# EasyEDA Pro project 第十三届国赛真题.eprj

# Schematic EDA_LQ_13F
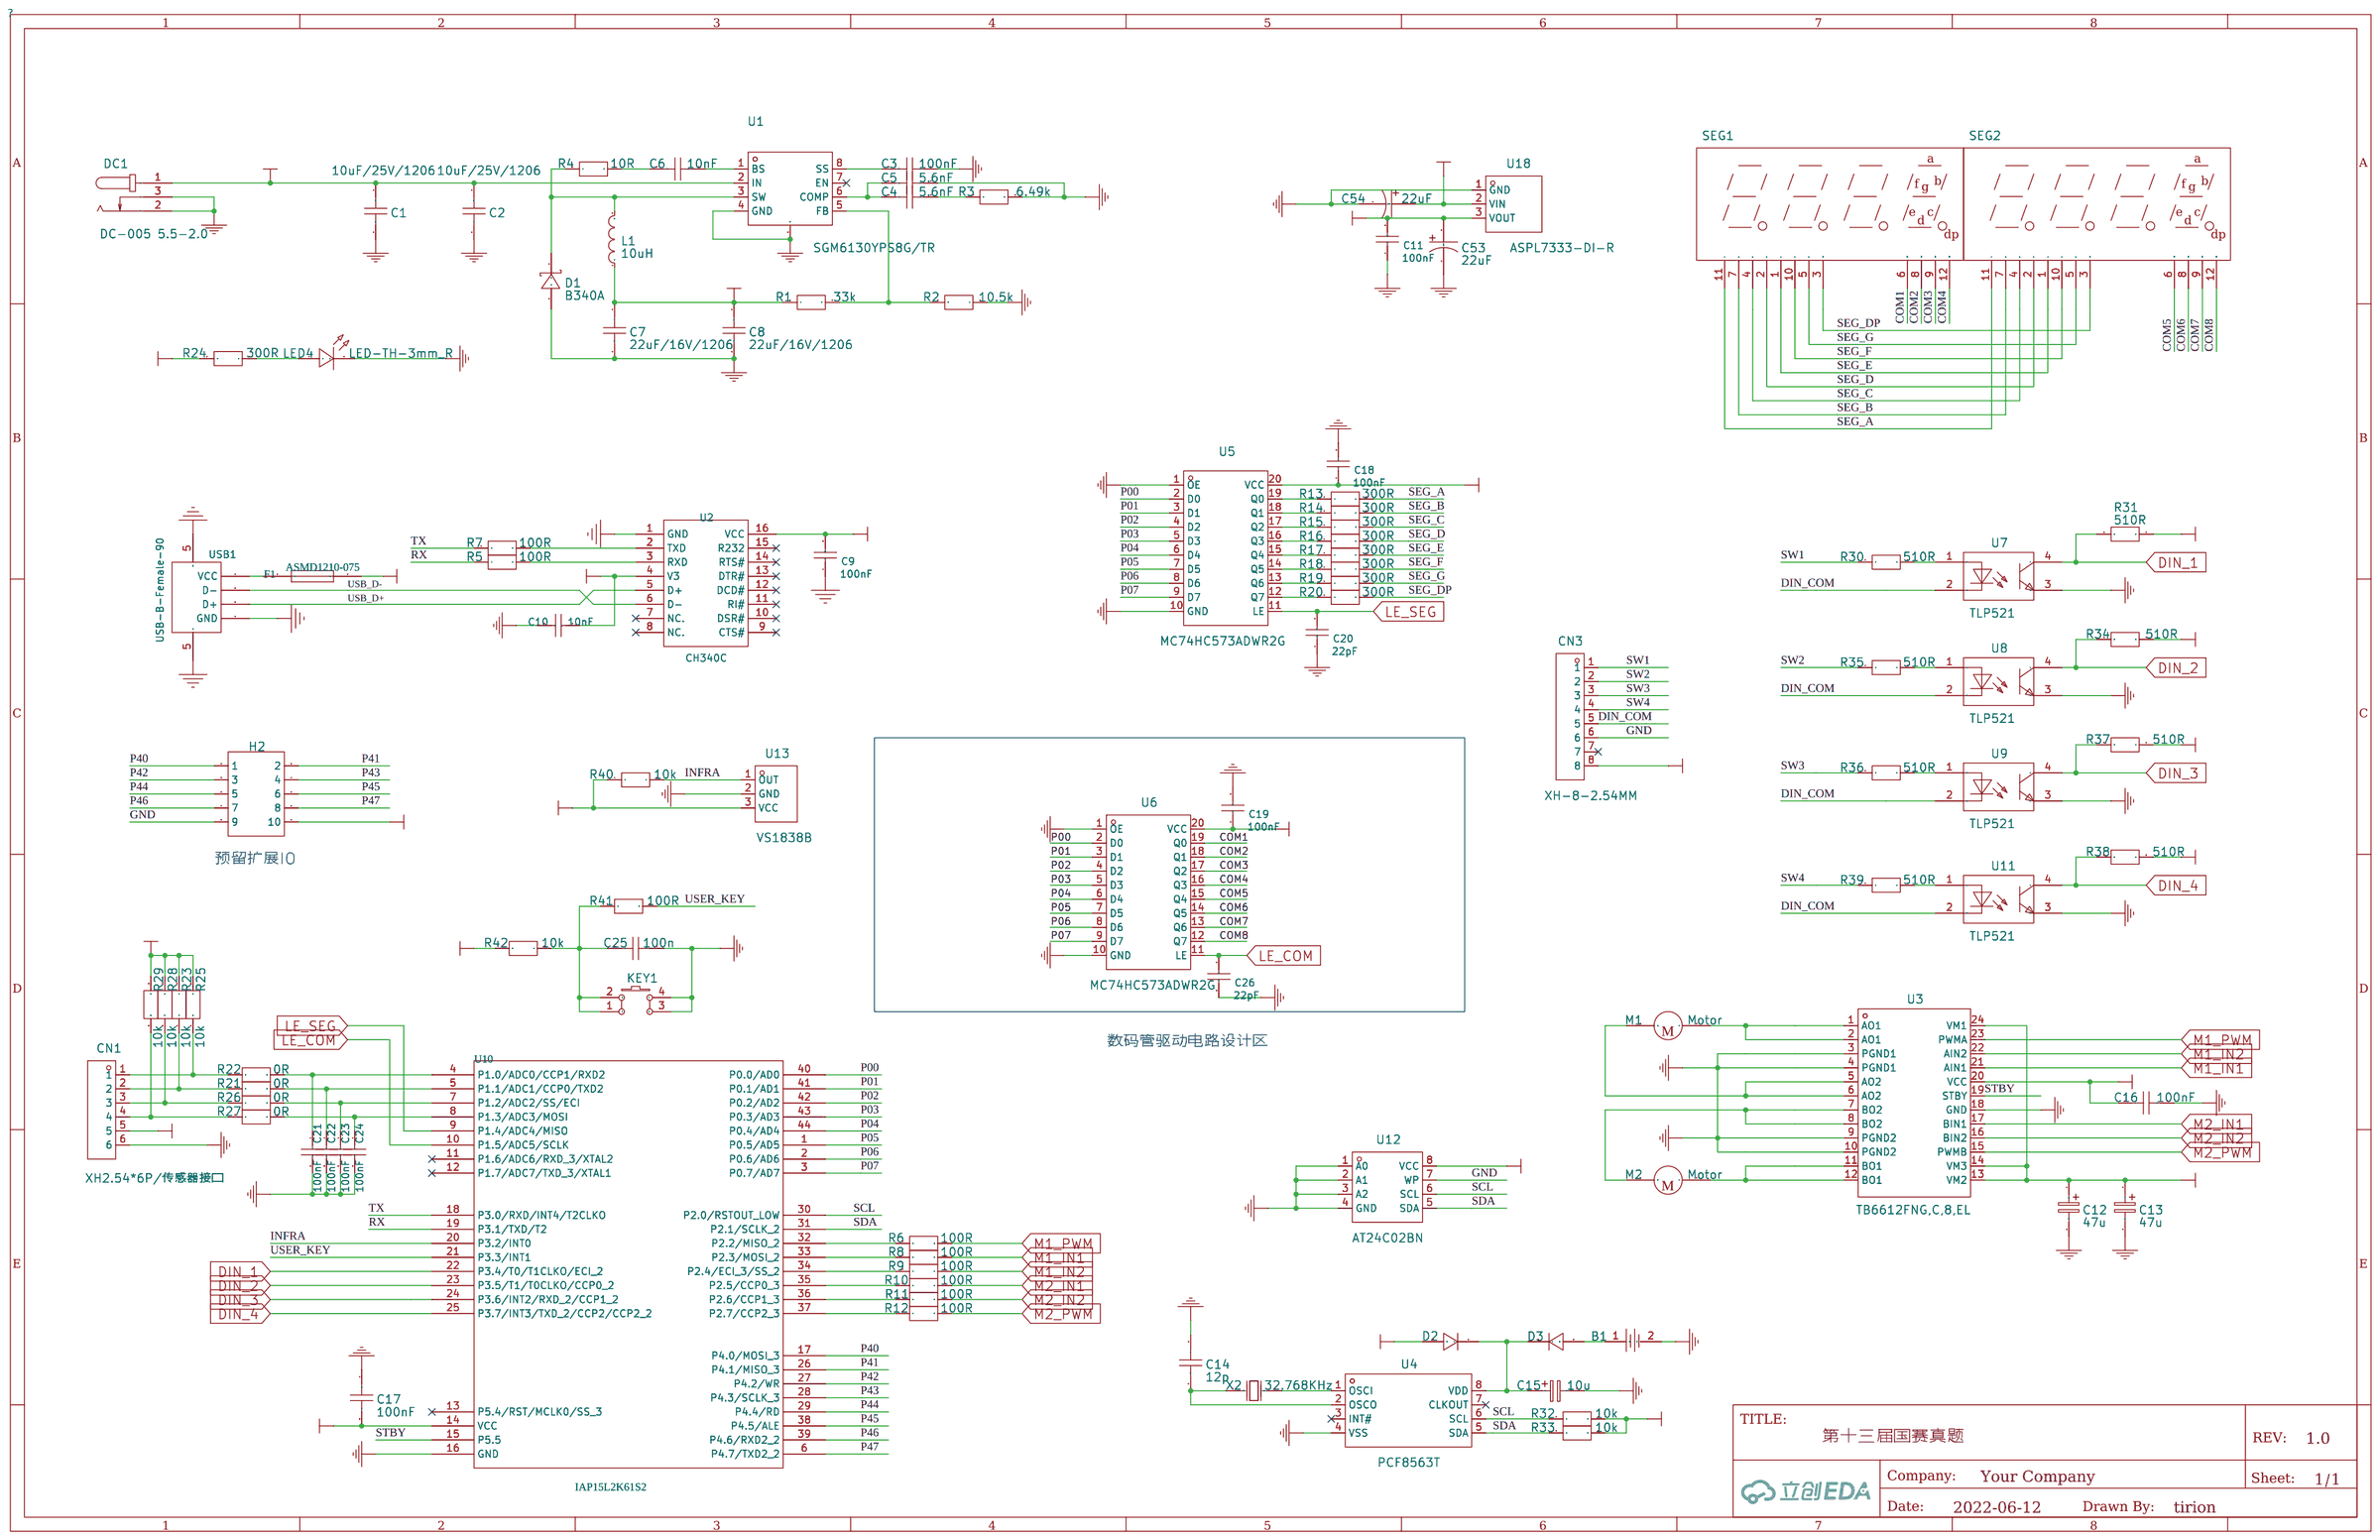
[diagram p0: schematic sheet]

## Parts
B1  CR1220-2  [BAT-SMD_CR1220-2]
C1  10uF/25V/1206  [C1206]
C2  10uF/25V/1206  [C1206]
C3  100nF  [C_C0805]
C4  5.6nF  [C_C0805]
C5  5.6nF  [C_C0805]
C6  10nF  [C_C0805]
C7  22uF/16V/1206  [C1206]
C8  22uF/16V/1206  [C1206]
C9  100nF  [C_C0805]
C10  10nF  [C_C0805]
C11  100nF  [C_C0805]
C12  47u  [CAP-D6.3×H5.5]
C13  47u  [CAP-D6.3×H5.5]
C14  12p  [C_C0805]
C15  10u  [CAP-D5.0×H5.5]
C16  100nF  [C_C0805]
C17  100nF  [C_C0805]
C18  100nF  [C_C0805]
C19  100nF  [C_C0805]
C20  22pF  [C_C0805]
C21  100nF  [C_C0805]
C22  100nF  [C_C0805]
C23  100nF  [C_C0805]
C24  100nF  [C_C0805]
C25  100n  [C_C0805]
C26  22pF  [C_C0805]
C53  22uF  [CAP-SMD_BD6.3-L6.6-W6.6-FD]
C54  22uF  [CAP-SMD_BD6.3-L6.6-W6.6-FD]
CN1  XH2.54*6P/传感器接口  [CONN-TH_XH2.54-6P]
CN3  XH-8-2.54MM  [CONN-TH_8P-P2.50-XH2.54-8P]
D1  B340A  [SMA_L4.3-W2.6-LS5.2-RD]
D2  1N4148  [DO-35_BD2.0-L4.2-P8.20-D0.5-RD]
D3  1N4148  [DO-35_BD2.0-L4.2-P8.20-D0.5-RD]
DC1  DC-005 5.5-2.0  [DC-IN-TH_DC005]
F1  ASMD1210-075  [R_R1210]
H2  HDR-F-2.54_2x5  [HDR-F-2.54_2X5]
KEY1  K4-6×6_SMD  [KEY-SMD_4P-L6.0-W6.0-P3.90-LS10.0]
L1  10uH  [IND-SMD_L8.3-W8.3]
LED4  LED-TH-3mm_R  [LED-TH_BD3.0_RED]
M1  Motor  [CONN-TH_2P-P5.08-WJ500V-5.08-2P]
M2  Motor  [CONN-TH_2P-P5.08-WJ500V-5.08-2P]
R1  33k  [R_R0805]
R2  10.5k  [R_R0805]
R3  6.49k  [R_R0805]
R4  10R  [R_R0805]
R5  100R  [R_R0805]
R6  100R  [R_R0805]
R7  100R  [R_R0805]
R8  100R  [R_R0805]
R9  100R  [R_R0805]
R10  100R  [R_R0805]
R11  100R  [R_R0805]
R12  100R  [R_R0805]
R13  300R  [R_R0805]
R14  300R  [R_R0805]
R15  300R  [R_R0805]
R16  300R  [R_R0805]
R17  300R  [R_R0805]
R18  300R  [R_R0805]
R19  300R  [R_R0805]
R20  300R  [R_R0805]
R21  0R  [R_R0805]
R22  0R  [R_R0805]
R23  10k  [R_R0805]
R24  300R  [R_R0805]
R25  10k  [R_R0805]
R26  0R  [R_R0805]
R27  0R  [R_R0805]
R28  10k  [R_R0805]
R29  10k  [R_R0805]
R30  510R  [R_R0805]
R31  510R  [R_R0805]
R32  10k  [R_R0805]
R33  10k  [R_R0805]
R34  510R  [R_R0805]
R35  510R  [R_R0805]
R36  510R  [R_R0805]
R37  510R  [R_R0805]
R38  510R  [R_R0805]
R39  510R  [R_R0805]
R40  10k  [R_R0805]
R41  100R  [R_R0805]
R42  10k  [R_R0805]
SEG1  0.36寸4位数码管  [LED-SEG-TH_FJ5461AH]
SEG2  0.36寸4位数码管  [LED-SEG-TH_FJ5461AH]
U1  SGM6130YPS8G/TR  [SOIC-8_L5.0-W4.0-P1.27-LS6.0-BL-EP2.0]
U2  CH340C  [SOP-16-N]
U3  TB6612FNG,C,8,EL  [SSOP-24_L8.3-W5.6-P0.65-LS7.6-BL]
U4  PCF8563T  [SOIC-8_L5.0-W4.0-P1.27-LS6.0-BL]
U5  MC74HC573ADWR2G  [SOIC-20_L13.0-W7.6-P1.27-LS10.3-BL]
U6  MC74HC573ADWR2G  [SOIC-20_L13.0-W7.6-P1.27-LS10.3-BL]
U7  TLP521  [OP-4]
U8  TLP521  [OP-4]
U9  TLP521  [OP-4]
U10  IAP15L2K61S2  [QFP-LQFP-44]
U11  TLP521  [OP-4]
U12  AT24C02BN  [SOP-8_L4.9-W3.9-P1.27-LS6.0-TL]
U13  VS1838B  [OPTO-TH_VS1838B]
U18  ASPL7333-DI-R  [SOT-89-3_L4.5-W2.5-P1.50-LS4.2-BR]
USB1  USB-B-Female-90  [S_USB-B]
X2  32.768KHz  [XTAL-DT38]

## Library data of the parts
B1 = CR1220-2: Supplier: LCSC; Manufacturer: Q&amp;J; Supplier Part: C70381; JLCPCB Part Class: ExtendedPart
C1 C2 = 10uF/25V/1206
C3 C16 C17 = 100nF
C4 C5 = 5.6nF
C6 = 10nF
C7 C8 = 22uF/16V/1206
C9-C11 C18-C24 C26 = 0805F104M500NT: Supplier: LCSC; Manufacturer: FH; Supplier Part: C28378
C12 C13 = 47u
C14 = 12p
C15 = 10u
C25 = 100n
C53 C54 = -: Supplier: LCSC; Supplier Part: C27783; Manufacturer: HonorElec
CN1 = XH2.54*6P_直插: Supplier: LCSC; Supplier Part: C9900008614; Manufacturer: null; JLCPCB Part Class: ExtendedPart
CN3 = XH-8-2.54MM: Supplier: LCSC; Supplier Part: C9900005540; JLCPCB Part Class: ExtendedPart
D1 = B340A: Supplier: LCSC; Manufacturer: MDD; Supplier Part: C64982; JLCPCB Part Class: Extended Part
D2 D3 = 1N4148: Supplier: LCSC; Supplier Part: C13769; Manufacturer: STMicroelectronics
DC1 = -: Supplier: LCSC; Supplier Part: C132516; Manufacturer: ShenzhenCankemeng; JLCPCB Part Class: Extended Part
F1 = ASMD1210-075: Published: 8-Jun-2000; LatestRevisionDate: 17-Jul-2002; LatestRevisionNote: Re-released for DXP Platform.; PackageReference: PIN-W2/E2.8; Publisher: Altium Limited; PackageDescription: Thru-Hole; 2 Leads
H2 = HDR-F-2.54_2x5: Supplier Part: C30419; Supplier: LCSC
KEY1 = K2-6639SP-D4SC-04: Supplier Part: C191626; Supplier: LCSC; Manufacturer: 韩国韩荣
L1 = 1217AS-H-100M=P3: Supplier: LCSC; Supplier Part: C237597; Manufacturer: MurataElectronics; JLCPCB Part Class: ExtendedPart
LED4 = 204-10SDRD/S530-A3-L: Manufacturer: EVERLIGHT(台湾亿光); Supplier Part: C84774; Supplier: LCSC
M1 M2 = Motor
R1 = 33k
R2 = 10.5k
R3 = 6.49k
R4 = 10R
R5-R12 R41 = 100R
R13-R20 R24 = 300R
R21 R22 R26 R27 = 0R
R23 R25 R28 R29 R32 R33 R40 R42 = 10k
R30 R31 R34-R39 = 510R
SEG1 SEG2 = FJ5461BH 纯红: Supplier: LCSC; Manufacturer Part: FJ5461BH纯红; Manufacturer: ReliaPro; Supplier Part: C38183
U1 = SGM6130YPS8G/TR: Supplier: LCSC; Manufacturer: SGMICRO; Supplier Part: C87094; JLCPCB Part Class: Extended Part
U2 = CH340C: Supplier: LCSC; Manufacturer: WCH; Supplier Part: C84681; JLCPCB Part Class: Extend
U3 = TB6612FNG,C,8,EL: Supplier: LCSC; Manufacturer: TOSHIBA; Supplier Part: C141517; JLCPCB Part Class: ExtendedPart
U4 = PCF8563T/5,518: Supplier: LCSC; Manufacturer: NXP; Supplier Part: C7440; JLCPCB Part Class: BasicPart
U5 U6 = MC74HC573ADWR2G: Supplier: LCSC; Supplier Part: C233618; Manufacturer: ONSemicon; JLCPCB Part Class: ExtendedPart
U7-U9 U11 = TLP521: Supplier: LCSC; Supplier Part: C9900005355; Manufacturer: null; link: https://atta.szlcsc.comnull; JLCPCB Part Class: ExtendedPart
U10 = IAP15L2K61S2: ________: STC15ϵ_е_Ƭ__
U12 = AT24C02BN: Supplier: LCSC; Supplier Part: C9900013198; Manufacturer: null; JLCPCB Part Class: ExtendedPart
U13 = VS1838B: Supplier: LCSC; Supplier Part: C9900002107; Manufacturer: null; JLCPCB Part Class: ExtendedPart
U18 = ASPL7333-DI-R: Supplier: LCSC; Supplier Part: C2758205; Manufacturer: Ascend(安森德); JLCPCB Part Class: Extended Part
USB1 = USB-BF90: Supplier: LCSC; Manufacturer: ValuePro; image: //image.lceda.cn/szlcsc/C46392.jpg; Supplier Part: C46392
X2 = 6K832768F12UB: Supplier: LCSC; Supplier Part: C252404; Manufacturer: SHENZHENCRYSTALTECH

## Nets
+3V3: C7.1 C8.1 C9.2 C10.1 C11.2 C16.1 C17.2 C18.1 C19.1 C53.1 CN1.5 D2.2 H2.10 L1.1 R1.1 R23.1 R24.2 R25.1 R28.1 R29.1 R31.1 R32.2 R33.2 R34.1 R37.1 R38.1 R40.1 R42.2 U2.4(V3) U2.16(VCC) U3.20(VCC) U5.20(VCC) U6.20(VCC) U10.14(VCC) U12.8(VCC) U13.3(VCC) U18.3(VOUT)
GND: B1.2 C1.1 C2.1 C3.1 C5.1 C7.2 C8.2 C9.1 C10.2 C11.1 C12.2 C13.2 C14.1 C15.2 C16.2 C17.1 C18.2 C19.2 C20.1 C21.2 C22.2 C23.2 C24.2 C25.2 C26.1 C53.2 C54.2 CN1.6 CN3.6 D1.2(A) DC1.2 DC1.3 H2.9 KEY1.3 KEY1.4 LED4.2 R2.1 R3.2 U1.4(GND) U1.9 U2.1(GND) U3.3(PGND1) U3.4(PGND1) U3.9(PGND2) U3.10(PGND2) U3.18(GND) U4.4(VSS) U5.1(OE) U5.10(GND) U6.1(OE) U6.10(GND) U7.3 U8.3 U9.3 U10.16(GND) U11.3 U12.1(A0) U12.2(A1) U12.3(A2) U12.4(GND) U12.7(WP) U13.2(GND) U18.1(GND) USB1.4(GND) USB1.5(SH2)
COM1: SEG1.6(DIG4) U6.19(Q0)
COM2: SEG1.8(DIG3) U6.18(Q1)
COM3: SEG1.9(DIG2) U6.17(Q2)
COM4: SEG1.12(DIG1) U6.16(Q3)
COM5: SEG2.6(DIG4) U6.15(Q4)
COM6: SEG2.8(DIG3) U6.14(Q5)
COM7: SEG2.9(DIG2) U6.13(Q6)
COM8: SEG2.12(DIG1) U6.12(Q7)
DC_IN: C1.2 C2.2 C12.1 C13.1 CN3.8 DC1.1 U1.2(IN) U3.13(VM2) U3.14(VM3) U3.24(VM1)
DIN_1: R31.2 U7.4 U10.22(P3.4/T0/T1CLKO/ECI_2)
DIN_2: R34.2 U8.4 U10.23(P3.5/T1/T0CLKO/CCP0_2)
DIN_3: R37.2 U9.4 U10.24(P3.6/INT2/RXD_2/CCP1_2)
DIN_4: R38.2 U10.25(P3.7/INT3/TXD_2/CCP2/CCP2_2) U11.4
DIN_COM: CN3.5 U7.2 U8.2 U9.2 U11.2
INFRA: R40.2 U10.20(P3.2/INT0) U13.1(OUT)
LE_COM: C26.2 U6.11(LE) U10.10(P1.5/ADC5/SCLK)
LE_SEG: C20.2 U5.11(LE) U10.9(P1.4/ADC4/MISO)
M1_IN1: R8.2 U3.21(AIN1)
M1_IN2: R9.2 U3.22(AIN2)
M1_PWM: R6.2 U3.23(PWMA)
M2_IN1: R10.2 U3.17(BIN1)
M2_IN2: R11.2 U3.16(BIN2)
M2_PWM: R12.2 U3.15(PWMB)
P00: U5.2(D0) U6.2(D0) U10.40(P0.0/AD0)
P01: U5.3(D1) U6.3(D1) U10.41(P0.1/AD1)
P02: U5.4(D2) U6.4(D2) U10.42(P0.2/AD2)
P03: U5.5(D3) U6.5(D3) U10.43(P0.3/AD3)
P04: U5.6(D4) U6.6(D4) U10.44(P0.4/AD4)
P05: U5.7(D5) U6.7(D5) U10.1(P0.5/AD5)
P06: U5.8(D6) U6.8(D6) U10.2(P0.6/AD6)
P07: U5.9(D7) U6.9(D7) U10.3(P0.7/AD7)
P40: H2.1 U10.17(P4.0/MOSI_3)
P41: H2.2 U10.26(P4.1/MISO_3)
P42: H2.3 U10.27(P4.2/WR)
P43: H2.4 U10.28(P4.3/SCLK_3)
P44: H2.5 U10.29(P4.4/RD)
P45: H2.6 U10.38(P4.5/ALE)
P46: H2.7 U10.39(P4.6/RXD2_2)
P47: H2.8 U10.6(P4.7/TXD2_2)
RX: R5.1 U10.19(P3.1/TXD/T2)
SCL: R32.1 U4.6(SCL) U10.30(P2.0/RSTOUT_LOW) U12.6(SCL)
SDA: R33.1 U4.5(SDA) U10.31(P2.1/SCLK_2) U12.5(SDA)
SEG_A: R13.2 SEG1.11(A) SEG2.11(A)
SEG_B: R14.2 SEG1.7(B) SEG2.7(B)
SEG_C: R15.2 SEG1.4(C) SEG2.4(C)
SEG_D: R16.2 SEG1.2(D) SEG2.2(D)
SEG_DP: R20.2 SEG1.3(DP) SEG2.3(DP)
SEG_E: R17.2 SEG1.1(E) SEG2.1(E)
SEG_F: R18.2 SEG1.10(F) SEG2.10(F)
SEG_G: R19.2 SEG1.5(G) SEG2.5(G)
STBY: U3.19(STBY) U10.15(P5.5)
SW1: CN3.1 R30.1
SW2: CN3.2 R35.1
SW3: CN3.3 R36.1
SW4: CN3.4 R39.1
TX: R7.1 U10.18(P3.0/RXD/INT4/T2CLKO)
USB_D+: U2.5(D+) USB1.3(D+)
USB_D-: U2.6(D-) USB1.2(D-)
USER_KEY: R41.1 U10.21(P3.3/INT1)
VUSB: C54.1 F1.2 U18.2(VIN)
$1N152: R1.2 R2.2 U1.5(FB)
$1N163: D1.1(K) L1.2 R4.1 U1.3(SW)
$1N174: C6.2 R4.2
$1N175: C6.1 U1.1(BS)
$1N178: C4.2 C5.2 U1.6(COMP)
$1N183: C4.1 R3.1
$1N190: C3.2 U1.8(SS)
$1N257: R5.2 U2.3(RXD)
$1N264: R7.2 U2.2(TXD)
$1N421: C15.1 D2.1 D3.1 U4.8(VDD)
$1N474: C14.2 U4.2(OSCO) X2.1(OSC1)
$1N475: U4.1(OSCI) X2.2(OSC2)
$1N489: B1.1 D3.2
$1N559: F1.1 USB1.1(VCC)
$1N587: LED4.1 R24.1
$1N603: M1.1 U3.1(AO1) U3.2(AO1)
$1N604: M1.2 U3.5(AO2) U3.6(AO2)
$1N614: M2.2 U3.7(BO2) U3.8(BO2)
$1N615: M2.1 U3.11(BO1) U3.12(BO1)
$1N755: R6.1 U10.32(P2.2/MISO_2)
$1N767: R8.1 U10.33(P2.3/MOSI_2)
$1N779: R9.1 U10.34(P2.4/ECI_3/SS_2)
$1N791: R10.1 U10.35(P2.5/CCP0_3)
$1N803: R11.1 U10.36(P2.6/CCP1_3)
$1N815: R12.1 U10.37(P2.7/CCP2_3)
$1N1018: R13.1 U5.19(Q0)
$1N1030: R14.1 U5.18(Q1)
$1N1042: R15.1 U5.17(Q2)
$1N1054: R16.1 U5.16(Q3)
$1N1066: R17.1 U5.15(Q4)
$1N1078: R18.1 U5.14(Q5)
$1N1090: R19.1 U5.13(Q6)
$1N1102: R20.1 U5.12(Q7)
$1N1137: CN1.2 R21.1 R23.2
$1N1138: C22.1 R21.2 U10.5(P1.1/ADC1/CCP0/TXD2)
$1N1139: CN1.1 R22.1 R25.2
$1N1140: C21.1 R22.2 U10.4(P1.0/ADC0/CCP1/RXD2)
$1N1172: CN1.3 R26.1 R28.2
$1N1173: C23.1 R26.2 U10.7(P1.2/ADC2/SS/ECI)
$1N1183: CN1.4 R27.1 R29.2
$1N1184: C24.1 R27.2 U10.8(P1.3/ADC3/MOSI)
$1N1282: R30.2 U7.1
$1N1335: R35.2 U8.1
$1N1380: R36.2 U9.1
$1N1445: R39.2 U11.1
$1N1633: C25.1 KEY1.1 KEY1.2 R41.2 R42.1

Not connected (* = marked no-connect by the designer): CN3 7*; U1 7(EN)*; U2 7(NC.)* 8(NC.)* 9(CTS#)* 10(DSR#)* 11(RI#)* 12(DCD#)* 13(DTR#)* 14(RTS#)* 15(R232)*; U4 3(INT#)* 7(CLKOUT)*; U10 11(P1.6/ADC6/RXD_3/XTAL2)* 12(P1.7/ADC7/TXD_3/XTAL1)* 13(P5.4/RST/MCLK0/SS_3)*

## Notes on the sheet
- 预留扩展IO
- 数码管驱动电路设计区

# Board PCB
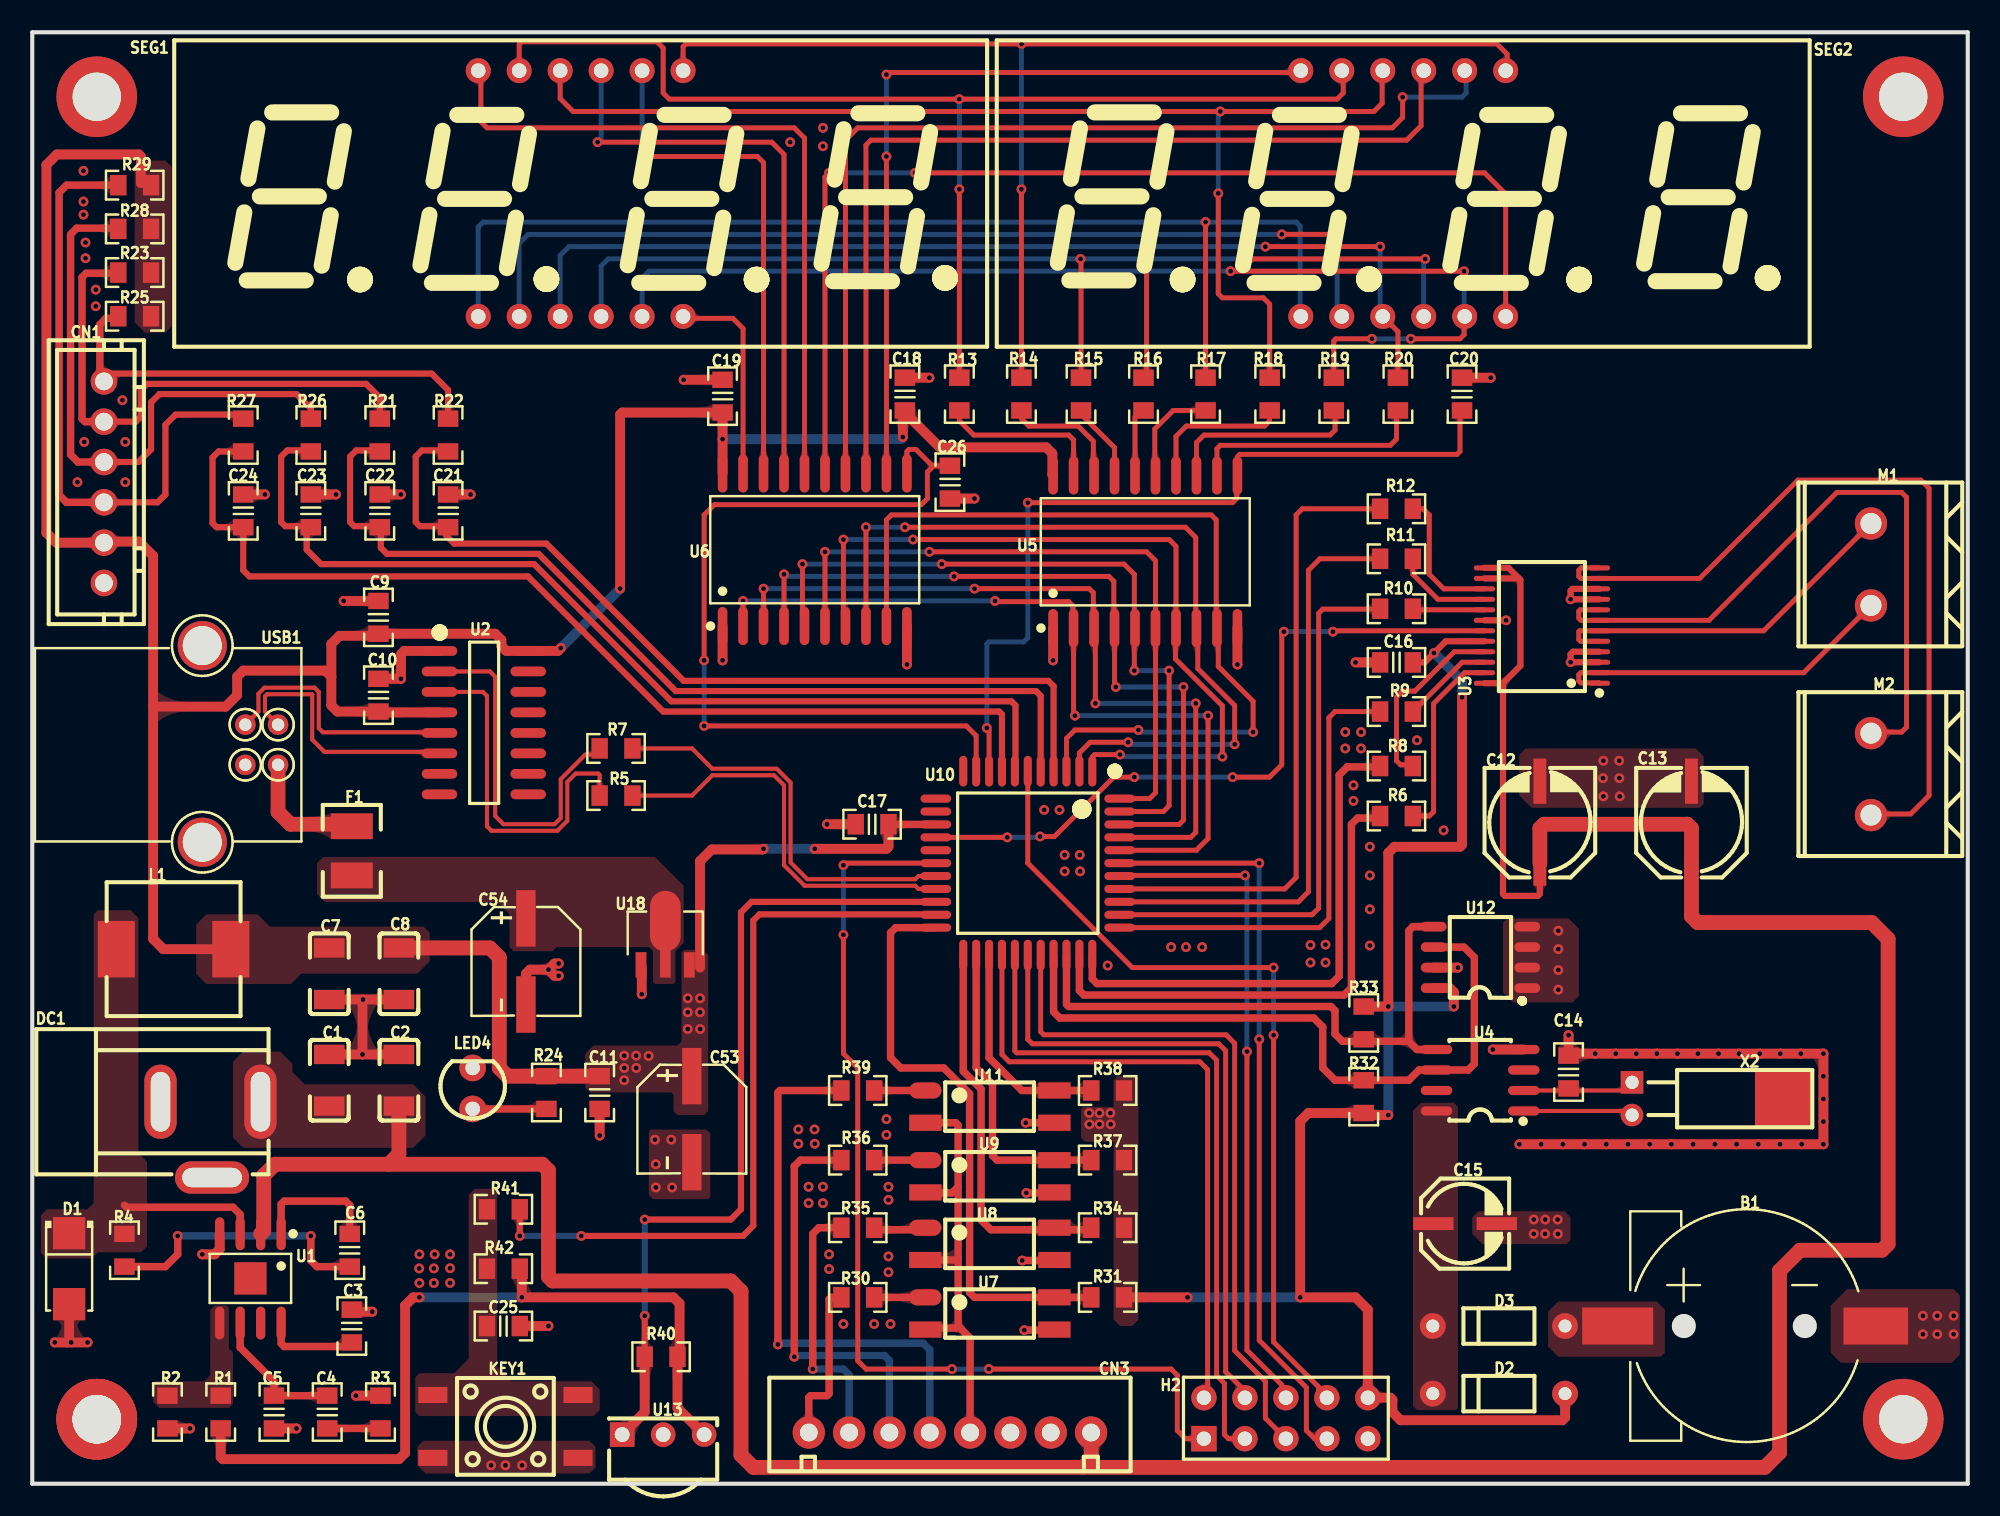
[diagram p1: board, top side]
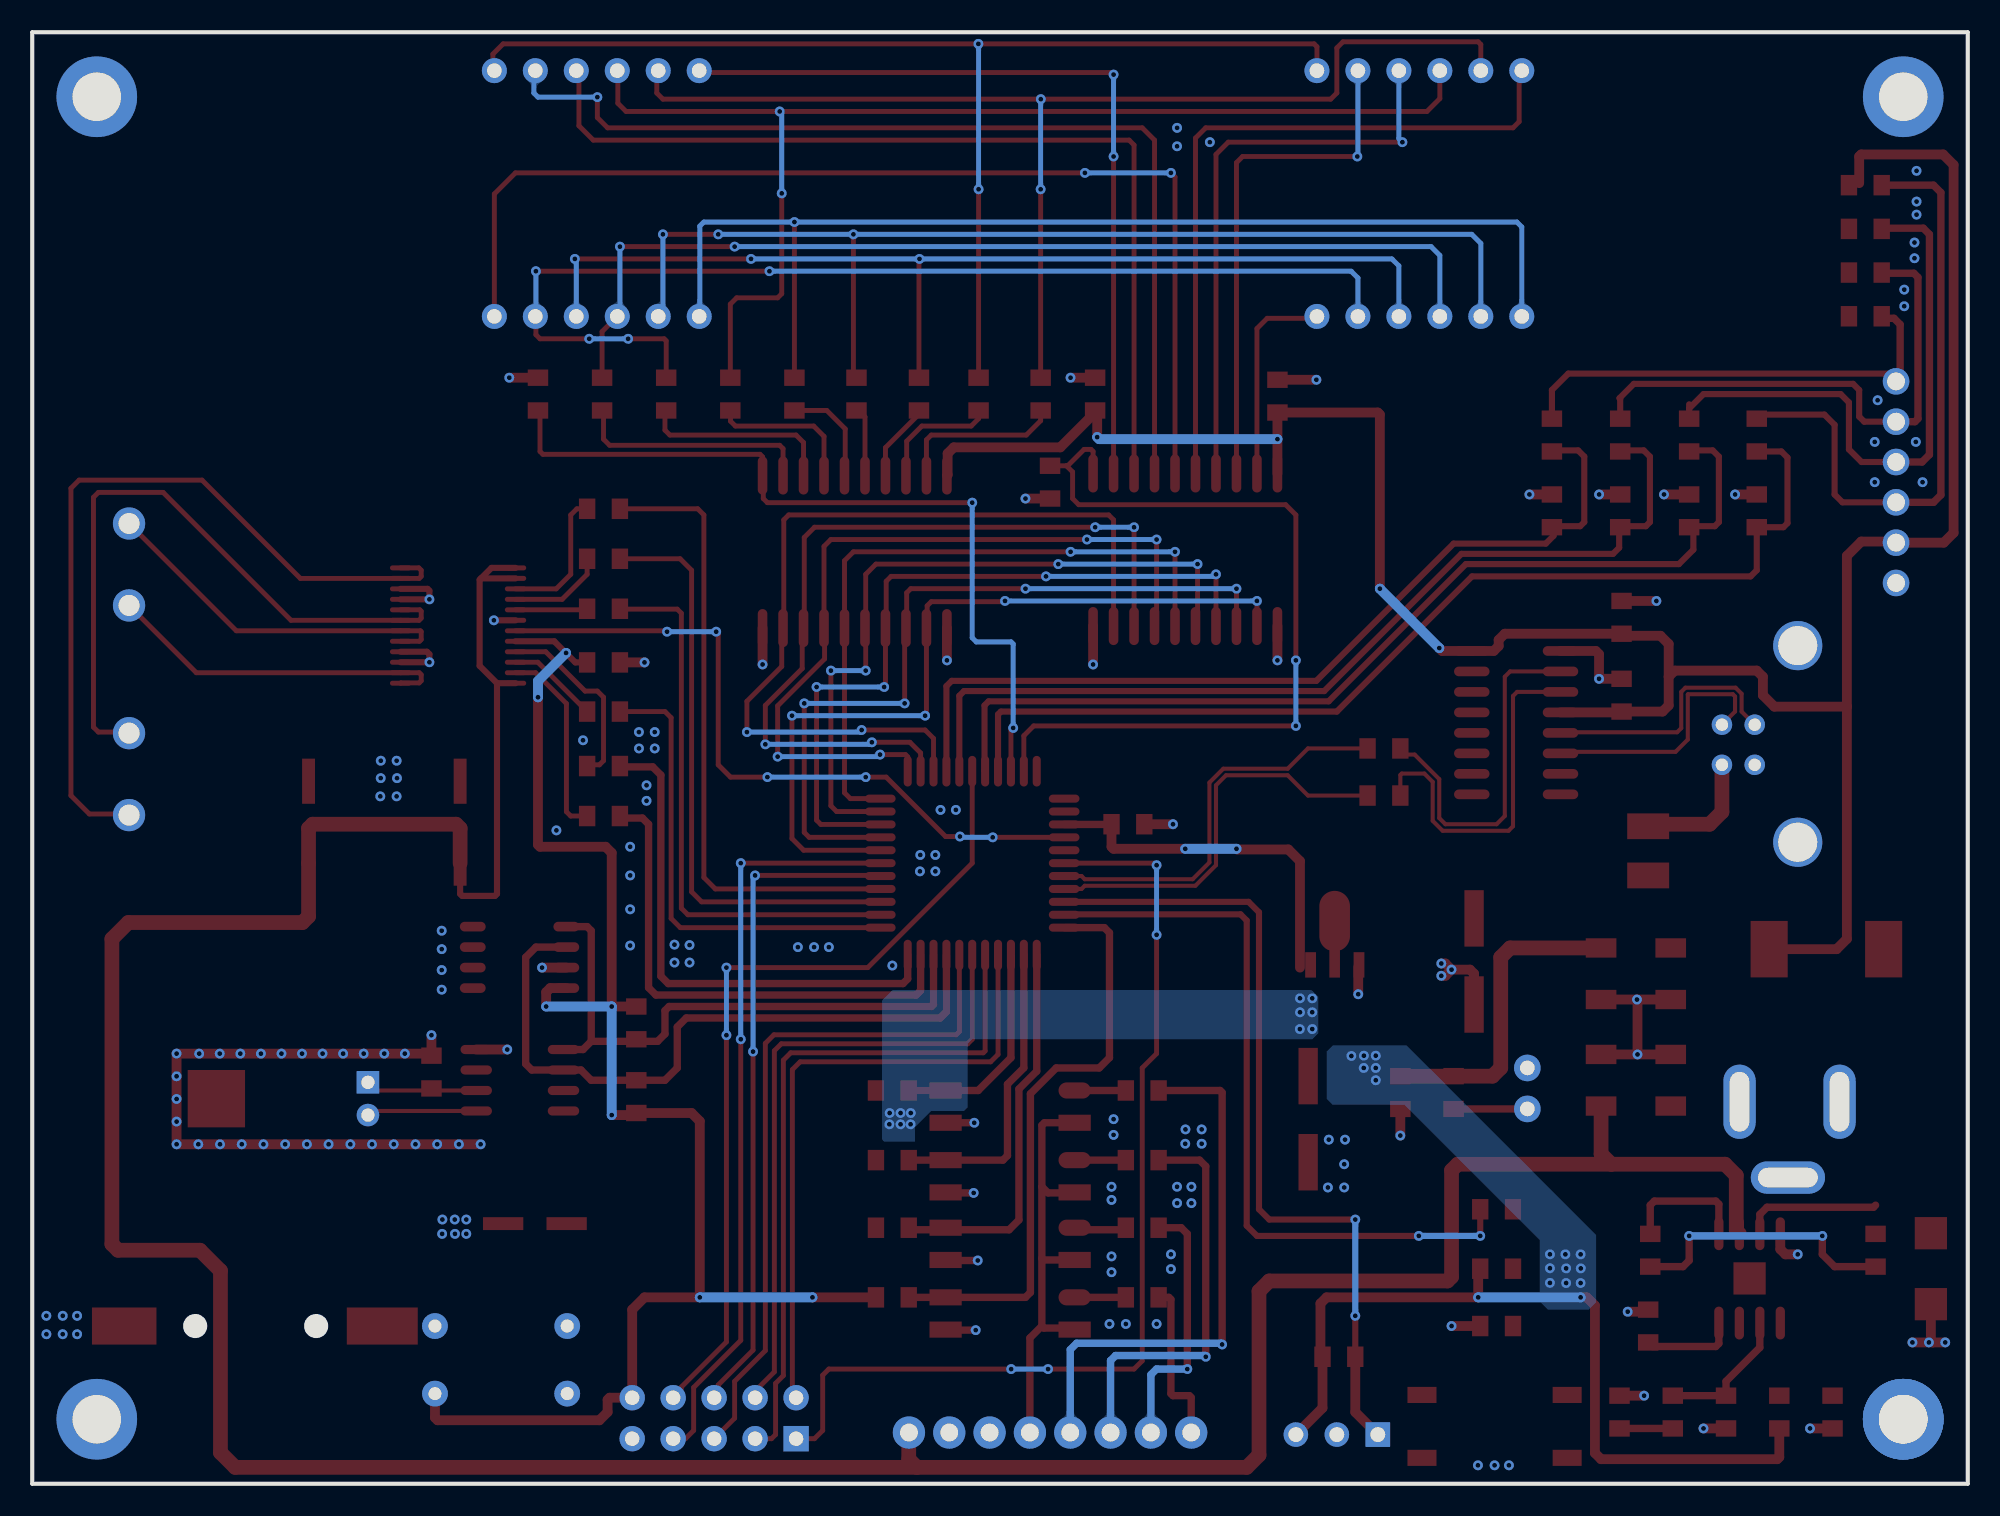
[diagram p2: board, bottom side, seen from below]

Outline 120 x 90 mm; copper layers: Top Layer, Bottom Layer. Coordinates in mm from the lower left corner of the outline.
Outline path: 0,90 120,90 120,0 0,0 0,90
Stack: Top Layer 0.035mm / Dielectric1 1.51mm FR4 er 4.5 / Bottom Layer 0.035mm

## Design rules (mm)
net USB_D+: DP1
net USB_D-: DP1
net $1N264: DP2
net $1N257: DP2
net TX: DP3
net RX: DP3
net $1N474: DP4
net $1N475: DP4
template: 用户自定义配置
spacing Default (default): track to track 0.254, other pairs 0 to 0.305
track width Default (default): min 0.305, default 0.305, max 25.4
track width PWR: min 0.305, default 0.61, max 2.54
differential pair differentialPair (default): width min 0.127, default 0.254, max 2.54; gap min 0.152, default 0.152
via Default (default): diameter min 0.61, default 0.61, max 100.025; hole min 0.305, default 0.305, max 59.995
net GND uses PWR
net +3V3 uses PWR
net VUSB uses PWR

## Placement (name value [footprint] x y rotation side)
B1  CR1220-2  [BAT-SMD_CR1220-2]  106.3 9.78 0 top
C1  10uF/25V/1206  [C1206]  18.42 25.02 270 top
C2  10uF/25V/1206  [C1206]  22.73 25.02 270 top
C3  100nF  [C_C0805]  19.81 10.79 270 top
C4  5.6nF  [C_C0805]  18.29 3.43 90 top
C5  5.6nF  [C_C0805]  14.99 3.43 90 top
C6  10nF  [C_C0805]  19.69 15.49 270 top
C7  22uF/16V/1206  [C1206]  18.42 31.62 270 top
C8  22uF/16V/1206  [C1206]  22.73 31.62 270 top
C9  100nF  [C_C0805]  21.46 54.74 270 top
C10  10nF  [C_C0805]  21.46 47.88 90 top
C11  100nF  [C_C0805]  35.18 23.24 90 top
C12  47u  [CAP-D6.3×H5.5]  93.47 43.56 270 top
C13  47u  [CAP-D6.3×H5.5]  102.87 43.56 270 top
C14  12p  [C_C0805]  95.25 26.54 270 top
C15  10u  [CAP-D5.0×H5.5]  90.81 16.13 180 top
C16  100nF  [C_C0805]  85.6 50.93 180 top
C17  100nF  [C_C0805]  51.05 40.89 0 top
C18  100nF  [C_C0805]  54.1 66.55 90 top
C19  100nF  [C_C0805]  42.8 66.42 90 top
C20  22pF  [C_C0805]  88.65 68.58 270 top
C21  100nF  [C_C0805]  25.78 59.31 90 top
C22  100nF  [C_C0805]  21.55 59.31 90 top
C23  100nF  [C_C0805]  17.27 59.31 90 top
C24  100nF  [C_C0805]  13.08 59.31 90 top
C25  100n  [C_C0805]  28.19 9.78 0 top
C26  22pF  [C_C0805]  56.9 61.09 90 top
C53  22uF  [CAP-SMD_BD6.3-L6.6-W6.6-FD]  40.89 22.61 270 top
C54  22uF  [CAP-SMD_BD6.3-L6.6-W6.6-FD]  30.61 32.39 270 top
CN1  XH2.54*6P/传感器接口  [CONN-TH_XH2.54-6P]  4.44 62.1 270 top
CN3  XH-8-2.54MM  [CONN-TH_8P-P2.50-XH2.54-8P]  56.9 3.18 180 top
D1  B340A  [SMA_L4.3-W2.6-LS5.2-RD]  2.29 13.34 270 top
D2  1N4148  [DO-35_BD2.0-L4.2-P8.20-D0.5-RD]  90.93 5.59 0 top
D3  1N4148  [DO-35_BD2.0-L4.2-P8.20-D0.5-RD]  90.93 9.78 0 top
DC1  DC-005 5.5-2.0  [DC-IN-TH_DC005]  11.05 21.34 0 top
F1  ASMD1210-075  [R_R1210]  19.81 40.77 270 top
H2  HDR-F-2.54_2x5  [HDR-F-2.54_2X5]  77.72 4.06 0 top
KEY1  K4-6×6_SMD  [KEY-SMD_4P-L6.0-W6.0-P3.90-LS10.0]  29.34 3.56 0 top
L1  10uH  [IND-SMD_L8.3-W8.3]  8.76 33.15 180 top
LED4  LED-TH-3mm_R  [LED-TH_BD3.0_RED]  27.31 24.51 180 top
M1  Motor  [CONN-TH_2P-P5.08-WJ500V-5.08-2P]  114 57 90 top
M2  Motor  [CONN-TH_2P-P5.08-WJ500V-5.08-2P]  114 44 90 top
NOREF  -  [Pad_e5]  4 86 0 top
NOREF#2  -  [Pad_e3]  116 4 0 top
NOREF#3  -  [Pad_e4]  4 4 0 top
NOREF#4  -  [Pad_e1]  4 4 0 top
NOREF#5  -  [Pad_e2]  4 4 0 top
NOREF#6  -  [Pad_e6]  116 86 0 top
R1  33k  [R_R0805]  11.68 3.43 90 top
R2  10.5k  [R_R0805]  8.38 3.43 90 top
R3  6.49k  [R_R0805]  21.59 3.43 90 top
R4  10R  [R_R0805]  5.72 15.49 270 top
R5  100R  [R_R0805]  37.21 42.67 180 top
R6  100R  [R_R0805]  83.57 41.4 0 top
R7  100R  [R_R0805]  37.21 45.59 180 top
R8  100R  [R_R0805]  83.57 44.5 0 top
R9  100R  [R_R0805]  83.57 47.88 0 top
R10  100R  [R_R0805]  83.57 54.25 0 top
R11  100R  [R_R0805]  83.57 57.35 0 top
R12  100R  [R_R0805]  83.57 60.45 0 top
R13  300R  [R_R0805]  57.48 66.55 90 top
R14  300R  [R_R0805]  61.33 66.55 90 top
R15  300R  [R_R0805]  65.02 66.55 90 top
R16  300R  [R_R0805]  68.9 66.55 90 top
R17  300R  [R_R0805]  72.75 66.55 90 top
R18  300R  [R_R0805]  76.72 66.55 90 top
R19  300R  [R_R0805]  80.7 66.55 90 top
R20  300R  [R_R0805]  84.67 66.55 90 top
R21  0R  [R_R0805]  21.55 66.04 270 top
R22  0R  [R_R0805]  25.78 66.04 270 top
R23  10k  [R_R0805]  7.37 75.1 180 top
R24  300R  [R_R0805]  31.88 23.24 90 top
R25  10k  [R_R0805]  7.37 72.39 180 top
R26  0R  [R_R0805]  17.27 66.04 270 top
R27  0R  [R_R0805]  13.08 66.04 270 top
R28  10k  [R_R0805]  7.37 77.81 180 top
R29  10k  [R_R0805]  7.37 80.52 180 top
R30  510R  [R_R0805]  50.16 11.56 0 top
R31  510R  [R_R0805]  67.69 11.56 180 top
R32  10k  [R_R0805]  82.55 25.02 270 top
R33  10k  [R_R0805]  82.55 27.56 90 top
R34  510R  [R_R0805]  67.69 15.88 180 top
R35  510R  [R_R0805]  50.16 15.88 0 top
R36  510R  [R_R0805]  50.16 20.07 0 top
R37  510R  [R_R0805]  67.69 20.07 180 top
R38  510R  [R_R0805]  67.69 24.38 180 top
R39  510R  [R_R0805]  50.16 24.38 0 top
R40  10k  [R_R0805]  40 7.87 180 top
R41  100R  [R_R0805]  30.23 17.02 180 top
R42  10k  [R_R0805]  28.19 13.34 0 top
SEG1  0.36寸4位数码管  [LED-SEG-TH_FJ5461AH]  34 80 0 top
SEG2  0.36寸4位数码管  [LED-SEG-TH_FJ5461AH]  85 80 0 top
U1  SGM6130YPS8G/TR  [SOIC-8_L5.0-W4.0-P1.27-LS6.0-BL-EP2.0]  13.53 12.73 180 top
U2  CH340C  [SOP-16-N]  22.61 52.2 0 top
U3  TB6612FNG,C,8,EL  [SSOP-24_L8.3-W5.6-P0.65-LS7.6-BL]  93.6 53.21 90 top
U4  PCF8563T  [SOIC-8_L5.0-W4.0-P1.27-LS6.0-BL]  89.77 25.02 90 top
U5  MC74HC573ADWR2G  [SOIC-20_L13.0-W7.6-P1.27-LS10.3-BL]  69.01 57.78 0 top
U6  MC74HC573ADWR2G  [SOIC-20_L13.0-W7.6-P1.27-LS10.3-BL]  48.51 57.91 0 top
U7  TLP521  [OP-4]  55.37 11.56 0 top
U8  TLP521  [OP-4]  55.37 15.88 0 top
U9  TLP521  [OP-4]  55.37 20.07 0 top
U10  IAP15L2K61S2  [QFP-LQFP-44]  59.18 46.48 270 top
U11  TLP521  [OP-4]  55.37 24.38 0 top
U12  AT24C02BN  [SOP-8_L4.9-W3.9-P1.27-LS6.0-TL]  89.79 32.64 180 top
U13  VS1838B  [OPTO-TH_VS1838B]  39.12 3.05 0 top
U18  ASPL7333-DI-R  [SOT-89-3_L4.5-W2.5-P1.50-LS4.2-BR]  39.24 33.53 270 top
USB1  USB-B-Female-90  [S_USB-B]  15.24 44.58 270 top
X2  32.768KHz  [XTAL-DT38]  99.19 24.89 90 top

## Footprints (pads in the part's own frame, mm; a bottom-side part is the same pattern mirrored in y, then rotated)
BAT-SMD_CR1220-2
  rect 4.4x2.3 smd: 1(-8,0)
  rect 4x2.3 smd: 2(8,0)
C1206
  rect 1.2x1.9 smd: 1(-1.6,0) 2(1.6,0)
C_C0805
  rect 1.016x1.27 smd: 1(0,0) 2(2.032,0)
CAP-D5.0×H5.5
  rect 2.5x0.8 smd: 1(3.937,0) 2(0,0)
CAP-D6.3×H5.5
  rect 2.8x0.8 smd: 1(5.08,0) 2(0,0)
CAP-SMD_BD6.3-L6.6-W6.6-FD
  rect 3.5x1.2 smd: 1(-2.67,0) 2(2.67,0)
CONN-TH_2P-P5.08-WJ500V-5.08-2P
  round 2 hole 1.3: 1(-2.54,0) 2(2.54,0)
CONN-TH_8P-P2.50-XH2.54-8P
  round 2 hole 1.1: 1(8.75,0) 2(6.25,0) 3(3.75,0) 4(1.25,0) 5(-1.25,0) 6(-3.75,0) 7(-6.25,0) 8(-8.75,0)
CONN-TH_XH2.54-6P
  round 1.65 hole 1.1: 1(-6.25,0) 2(-3.75,0) 3(-1.25,0) 4(1.25,0) 5(3.751,0) 6(6.25,0)
DC-IN-TH_DC005
  oval 2x4.6 hole 1.2x3.7: 1(3.1,2.35) 2(-3.099,2.35)
  oval 4.6x2 hole 3.7x1.2: 3(0.1,-2.35)
DO-35_BD2.0-L4.2-P8.20-D0.5-RD
  round 1.6 hole 0.8: 1(-4.1,0) 2(4.1,0)
HDR-F-2.54_2X5
  rect 1.575x1.575 hole 0.889: 1(-5.08,-1.27)
  round 1.575 hole 0.889: 2(-5.08,1.27) 3(-2.54,-1.27) 4(-2.54,1.27) 5(0,-1.27) 6(0,1.27) 7(2.54,-1.27) 8(2.54,1.27) 9(5.08,-1.27) 10(5.08,1.27)
IND-SMD_L8.3-W8.3
  rect 2.3x3.5 smd: 1(-3.55,0) 2(3.55,0)
KEY-SMD_4P-L6.0-W6.0-P3.90-LS10.0
  rect 1.8x1 smd: 1(-4.5,1.95) 2(4.5,1.95) 3(-4.5,-1.95) 4(4.5,-1.95)
LED-SEG-TH_FJ5461AH
  round 1.55 hole 0.9: 1(-6.35,-7.62) 2(-3.81,-7.62) 3(-1.27,-7.62) 4(1.27,-7.62) 5(3.81,-7.62) 6(6.35,-7.62) 7(6.35,7.62) 8(3.81,7.62) 9(1.27,7.62) 10(-1.27,7.62) 11(-3.81,7.62) 12(-6.35,7.62)
LED-TH_BD3.0_RED
  round 1.651 hole 0.9: 1(0,1.27) 2(0,-1.27)
OP-4
  oval 2x1 smd: 1(0,0)
  rect 2x1 smd: 2(0,-2) 3(8,-2) 4(8,0)
OPTO-TH_VS1838B
  rect 1.524x1.524 hole 0.914: 1(-2.54,0)
  round 1.524 hole 0.914: 2(0,0) 3(2.54,0)
Pad_e1
  round 5 hole 3: 1(0,0)
Pad_e2
  round 5 hole 3: 1(0,0)
Pad_e3
  round 5 hole 3: 1(0,0)
Pad_e4
  round 5 hole 3: 1(0,0)
Pad_e5
  round 5 hole 3: 1(0,0)
Pad_e6
  round 5 hole 3: 1(0,0)
QFP-LQFP-44
  oval 1.9x0.5 smd: 1(2.301,6.54) 2(2.301,5.74) 3(2.301,4.94) 4(2.301,4.14) 5(2.301,3.34) 6(2.301,2.54) 7(2.301,1.74) 8(2.301,0.94) 9(2.301,0.14) 10(2.301,-0.66) 11(2.301,-1.46) 23(13.701,-1.46) 24(13.701,-0.66) 25(13.701,0.14) 26(13.701,0.94) 27(13.701,1.74) 28(13.701,2.54) 29(13.701,3.34) 30(13.701,4.14) 31(13.701,4.94) 32(13.701,5.74) 33(13.701,6.54)
  oval 0.5x1.9 smd: 12(4.001,-3.16) 13(4.801,-3.16) 14(5.601,-3.16) 15(6.401,-3.16) 16(7.201,-3.16) 17(8.001,-3.16) 18(8.801,-3.16) 19(9.601,-3.16) 20(10.401,-3.16) 21(11.201,-3.16) 22(12.001,-3.16) 34(12.001,8.24) 35(11.201,8.24) 36(10.401,8.24) 37(9.601,8.24) 38(8.801,8.24) 39(8.001,8.24) 40(7.201,8.24) 41(6.401,8.24) 42(5.601,8.24) 43(4.801,8.24) 44(4.001,8.24)
R_R0805
  rect 1.016x1.27 smd: 1(0,0) 2(2.032,0)
R_R1210
  rect 1.6x2.6 smd: 1(0,0) 2(3.048,0)
S_USB-B
  round 1.27 hole 0.767x0.762: 1(0,0) 2(-2.489,0) 3(-2.489,-2.032) 4(0,-2.032)
  round 3.048 hole 2.418x2.413: 5(4.801,-4.699) 6(-7.391,-4.699)
SMA_L4.3-W2.6-LS5.2-RD
  rect 2x2 smd: 1(-2.2,0) 2(2.2,0)
SOIC-8_L5.0-W4.0-P1.27-LS6.0-BL
  oval 0.569x1.95 smd: 1(-1.905,-2.705) 2(-0.635,-2.705) 3(0.635,-2.705) 4(1.905,-2.705) 5(1.905,2.705) 6(0.635,2.705) 7(-0.635,2.705) 8(-1.905,2.705)
SOIC-8_L5.0-W4.0-P1.27-LS6.0-BL-EP2.0
  oval 0.574x2.038 smd: 1(-1.905,-2.769) 2(-0.635,-2.769) 3(0.635,-2.769) 4(1.905,-2.769) 5(1.905,2.769) 6(0.635,2.769) 7(-0.635,2.769) 8(-1.905,2.769)
  rect 2x2 smd: 9(0,0)
SOIC-20_L13.0-W7.6-P1.27-LS10.3-BL
  oval 0.595x2.36 smd: 1(-5.715,-4.73) 2(-4.445,-4.73) 3(-3.175,-4.73) 4(-1.905,-4.73) 5(-0.635,-4.73) 6(0.635,-4.73) 7(1.905,-4.73) 8(3.175,-4.73) 9(4.445,-4.73) 10(5.715,-4.73) 11(5.715,4.73) 12(4.445,4.73) 13(3.175,4.73) 14(1.905,4.73) 15(0.635,4.73) 16(-0.635,4.73) 17(-1.905,4.73) 18(-3.175,4.73) 19(-4.445,4.73) 20(-5.715,4.73)
SOP-8_L4.9-W3.9-P1.27-LS6.0-TL
  oval 1.6x0.6 smd: 1(-2.9,1.905) 2(-2.9,0.635) 3(-2.9,-0.635) 4(-2.9,-1.905) 5(2.9,-1.905) 6(2.9,-0.635) 7(2.9,0.635) 8(2.9,1.905)
SOP-16-N
  oval 2.2x0.6 smd: 1(2.643,-0.559) 2(2.643,-1.829) 3(2.643,-3.099) 4(2.643,-4.37) 5(2.643,-5.639) 6(2.643,-6.91) 7(2.643,-8.18) 8(2.643,-9.45) 9(8.143,-9.45) 10(8.143,-8.18) 11(8.143,-6.91) 12(8.143,-5.639) 13(8.143,-4.37) 14(8.143,-3.099) 15(8.143,-1.829) 16(8.143,-0.559)
SOT-89-3_L4.5-W2.5-P1.50-LS4.2-BR
  rect 1.575x0.672 smd: 1(1.357,-1.5) 3(1.357,1.5)
  custom 5.377x1.9 smd: 2(-1.356,0.009)
SSOP-24_L8.3-W5.6-P0.65-LS7.6-BL
  oval 0.308x1.324 smd: 1(-3.575,-3.562) 2(-2.925,-3.562) 3(-2.275,-3.562) 4(-1.625,-3.562) 5(-0.975,-3.562) 6(-0.325,-3.562) 7(0.325,-3.562) 8(0.975,-3.562) 9(1.625,-3.562) 10(2.275,-3.562) 11(2.925,-3.562) 12(3.575,-3.562) 13(3.575,3.562) 14(2.925,3.562) 15(2.275,3.562) 16(1.625,3.562) 17(0.975,3.562) 18(0.325,3.562) 19(-0.325,3.562) 20(-0.975,3.562) 21(-1.625,3.562) 22(-2.275,3.562) 23(-2.925,3.562) 24(-3.575,3.562)
XTAL-DT38
  rect 3.556x3.556 smd: 0(-1.016,-9.398)
  rect 1.397x1.397 hole 0.818x0.813: 1(0,0)
  round 1.397 hole 0.818x0.813: 2(-2.032,0)

## Nets
As in the schematic.

Pads without a net: CN3 7; NOREF 1; NOREF#2 1; NOREF#3 1; NOREF#4 1; NOREF#5 1; NOREF#6 1; U1 7; U2 7 8 9 10 11 12 13 14 15; U4 3 7; U10 11 12 13; USB1 6; X2 0

## Via types
v1: diameter 0.61, hole 0.305, Top Layer to Bottom Layer, 287 vias

## Routing (per net, layer and track width the routed paths; a pad name or vN(x,y) marks a point on that pad's centre or on a via; arc(x,y) is an arc through that point)
+3V3: length 348.3
  Top Layer w0.381: C16.1 86.33,50.93 87.64,52.24 U3.20
  Top Layer w0.457: U10.14 53.1,40.88 C17.2
  Top Layer w0.61: 54.04,66.48 56.26,64.26 62.87,64.26 63.25,63.88 63.25,62.56 U5.20 ; 54.04,66.48 53.97,66.42 v1(53.97,64.9) ; 54.04,66.48 C18.1 ; U13.3 40,4.7 R40.1 40.13,8 40.13,11.18 39.75,11.56 v1(30.35,11.56) 30.35,13.21 R42.2 ; v1(45.34,39.37) 45.3,39.33 42.12,39.33 41.4,38.61 41.4,32 ; 18.54,50.04 18.54,48.26 18.92,47.88 C10.1 21.51,47.83 U2.4 ; 18.54,50.04 18.16,50.42 13.08,50.42 12.7,50.04 12.7,48.89 11.99,48.18 7.49,48.18 ; 18.54,50.04 18.54,52.07 19.05,52.58 21.34,52.58 C9.2 28.7,52.7 29.08,52.32 29.08,51.94 29.39,51.64 U2.16 32.59,51.64 v1(32.77,51.82) ; 82.55,23.11 82.42,22.99 79.12,22.99 78.61,22.48 v1(78.61,11.56) 82.04,11.56 82.8,10.79 H2.10 84.2,5.33 84.33,5.21 84.33,4.44 84.84,3.94 94.87,3.94 95.03,4.1 D2.2 ; v1(48.51,39.37) 52.96,39.37 53.09,39.5 C17.2 ; L1.1 8.13,33.15 7.49,33.78 7.49,48.18 ; 82.68,22.86 v1(84.07,22.86) ; 6.73,80.64 6.73,82.3 6.6,82.42 1.52,82.42 0.88,81.78 0.88,58.96 1.49,58.35 4.19,58.35 4.26,58.42 6.6,58.42 7.49,57.53 7.49,48.18 ; R1.1 11.68,1.65 11.81,1.52 22.73,1.52 23.11,1.91 23.11,11.05 23.62,11.56 v1(24,11.56) ; v1(88.14,29.59) 88.14,30.48 87.88,30.73 U12.8 ; U6.20 v1(42.8,64.77) C19.1 36.58,66.42 36.45,66.29 v1(36.45,55.5) ; R31.1 v1(71.63,11.56) ; v1(88.65,48.77) 88.65,39.62 88.52,39.5 84.46,39.5 84.07,39.12 v1(84.07,29.59) R33.2
  Top Layer w0.914: C11.2 R24.2 29.46,25.27 28.96,25.78 28.96,32.64 28.37,33.22 C8.1
  Bottom Layer w0.61: v1(53.97,64.9) 53.85,64.77 v1(42.8,64.77) ; v1(86.91,51.51) 88.65,49.77 v1(88.65,48.77) ; v1(71.63,11.56) v1(78.61,11.56) ; v1(88.14,29.59) v1(84.07,29.59) v1(84.07,22.86) ; v1(32.77,51.82) v1(36.45,55.5) ; v1(30.35,11.56) v1(24,11.56) ; v1(48.51,39.37) v1(45.34,39.37)
  vias: v1(24,14.22) v1(23.99,13.35) v1(24,12.45) v1(24.95,14.22) v1(24.9,13.35) v1(24.9,12.45) v1(25.9,14.22) v1(25.9,13.36) v1(25.9,12.45) v1(36.7,26.54) v1(36.7,25.78) v1(36.7,25.02) v1(37.44,26.54) v1(37.45,25.78) v1(38.22,26.53) v1(40.64,30.1) v1(40.64,29.23) v1(40.64,28.19) v1(41.4,30.1) v1(41.4,29.23) v1(41.41,28.19) v1(65.53,22.99) v1(65.54,22.29) v1(66.17,22.99) v1(66.17,22.29) v1(66.84,22.99) v1(66.86,22.29)
GND: length 128.4
  Top Layer w0.381: U3.3 v1(95.38,50.94) 95.38,51.44 95.53,51.59 U3.4 ; v1(91.38,53.54) U3.18 ; U3.9 v1(95.38,54.84) 95.38,55.37 95.49,55.49 U3.10
  Top Layer w0.457: 63.41,18.03 v1(61.63,18.03) ; U11.3 v1(61.59,22.38) ; 63.28,9.53 v1(61.51,9.53) ; 63.16,13.84 v1(61.38,13.84)
  Top Layer w0.61: v1(18.83,61.34) 17.49,61.34 ; v1(21.08,10.67) 19.94,10.67 C3.1 ; v1(14.42,61.34) C24.2 ; 2.16,8.76 v1(1.4,8.76) ; 2.16,8.76 v1(3.43,8.76) ; 2.16,8.76 2.29,8.89 D1.2 ; v1(20.47,26.62) C2.1 ; v1(20.47,26.62) C1.1 ; v1(20.47,26.62) 20.47,29.99 v1(20.51,30.02) ; R3.2 v1(20.07,5.46) ; v1(32,31.88) 30.86,31.88 30.61,31.62 C54.2 ; v1(32,31.88) 32.39,31.5 v1(32.64,31.5) ; v1(32,31.88) 32.39,32.26 v1(32.64,32.26) ; C10.2 v1(22.86,49.91) 22.86,51.44 23.06,51.64 U2.1 ; v1(10.54,14.22) 11.3,14.22 11.62,14.54 11.62,15.5 ; U6.10 v1(54.23,50.8) ; 37.79,32.02 v1(37.79,30.35) ; C26.1 v1(58.42,61.09) ; C20.1 v1(90.42,68.58) ; v1(20.51,30.02) C8.2 ; v1(20.51,30.02) C7.2 ; 63.29,53.06 v1(63.29,51.05) ; C9.1 v1(19.3,54.74) ; v1(92.2,21.05) v1(93.55,21.05) v1(94.9,21.05) v1(96.24,21.05) v1(97.59,21.05) v1(98.93,21.05) v1(100.28,21.05) v1(101.63,21.05) v1(102.97,21.05) v1(104.32,21.05) v1(105.67,21.05) v1(107.01,21.05) v1(108.36,21.05) v1(109.71,21.05) v1(111.05,21.05) v1(111.05,22.45) v1(111.05,23.86) v1(111.05,25.26) v1(111.05,26.67) v1(109.65,26.67) v1(108.38,26.67) v1(107.1,26.67) v1(105.83,26.67) v1(104.55,26.67) v1(103.28,26.67) v1(102,26.67) v1(100.73,26.67) v1(99.45,26.67) v1(98.18,26.67) v1(96.9,26.67) 95.38,26.67 C14.1 v1(95.25,27.81) ; v1(88.39,32) U12.7 ; C25.2 v1(32,9.78) ; C17.1 v1(49.28,40.89) ; C18.2 v1(55.63,68.58) ; U6.1 v1(42.8,51.05) ; U4.4 v1(90.55,26.92) ; 74.72,53.06 v1(74.72,50.8) ; v1(9.78,3.43) R2.1 ; C11.1 v1(35.18,21.59) ; v1(27.18,61.34) 25.83,61.34 ; C5.1 v1(16.38,3.43) ; C19.2 v1(40.39,68.45) ; C16.2 v1(82.04,50.93) ; v1(22.85,61.34) 21.51,61.34
  Bottom Layer w0.381: v1(95.38,54.84) 95.38,54.86
  vias: v1(2.41,8.76) v1(2.8,62.1) v1(3.17,81.41) v1(3.17,79.5) v1(3.17,78.69) v1(3.22,64.6) v1(3.3,76.96) v1(3.3,75.99) v1(3.94,74.04) v1(3.94,73.01) v1(5.59,67.18) v1(5.77,64.6) v1(5.77,62.1) v1(28.45,1.14) v1(29.34,1.14) v1(30.37,1.14) v1(38.61,21.34) v1(38.66,19.81) v1(38.66,18.37) v1(39.62,21.34) v1(39.67,18.37) v1(46.99,83.19) v1(47.5,21.97) v1(47.5,21.08) v1(48.13,18.41) v1(48.13,17.4) v1(48.5,21.97) v1(48.51,21.08) v1(49.02,84.07) v1(49.02,82.93) v1(49.02,18.41) v1(49.02,17.4) v1(49.4,14.22) v1(49.4,13.31) v1(50.29,9.91) v1(52.2,9.91) v1(52.96,22.61) v1(52.96,21.63) v1(53.09,18.41) v1(53.09,17.6) v1(53.09,14.1) v1(53.09,13.12) v1(53.21,9.91) v1(62.74,41.78) v1(63.69,41.78) v1(64.01,38.99) v1(64.01,37.97) v1(64.94,38.99) v1(64.97,37.97) v1(66.68,32.13) v1(70.61,33.27) v1(71.53,33.27) v1(72.53,33.27) v1(79.25,33.4) v1(79.25,32.32) v1(80.18,33.43) v1(80.18,32.32) v1(81.41,46.61) v1(81.41,45.59) v1(81.91,43.31) v1(81.91,42.34) v1(82.39,46.61) v1(82.38,45.59) v1(82.93,39.5) v1(82.93,37.72) v1(82.93,35.62) v1(82.93,33.37) v1(85.85,46.1) v1(87.5,40.51) v1(93.09,16.38) v1(93.09,15.49) v1(93.81,16.38) v1(93.79,15.49) v1(94.62,34.29) v1(94.62,33.15) v1(94.62,31.85) v1(94.62,30.63) v1(94.57,16.38) v1(94.59,15.49) v1(97.41,44.83) v1(97.39,43.75) v1(97.41,42.62) v1(98.39,44.83) v1(98.4,43.75) v1(98.42,42.62) v1(117.22,10.41) v1(117.22,9.27) v1(118.11,10.41) v1(118.11,9.27) v1(119.13,10.41) v1(119.12,9.27)
COM1: length 13
  Top Layer w0.305: 44.07,62.64 44.07,71.63 43.43,72.26 40.47,72.26 SEG1.6
COM2: length 32.3
  Top Layer w0.305: U6.18 45.34,81.92 44.96,82.3 v1(37.85,82.3)
  Bottom Layer w0.305: v1(37.85,82.3) 37.81,82.33 SEG1.8
COM3: length 36.2
  Top Layer w0.305: v1(35.05,83.19) 45.85,83.19 46.61,82.42 U6.17
  Bottom Layer w0.305: v1(35.05,83.19) 35.27,83.4 SEG1.9
COM4: length 44.5
  Top Layer w0.305: U6.16 47.88,83.44 47.24,84.07 28.19,84.07 27.81,84.45 27.81,87.46 SEG1.12
COM5: length 68.8
  Top Layer w0.305: v1(54.74,81.28) 90.04,81.28 91.35,79.97 SEG2.6 ; v1(49.4,81.28) 49.15,81.03 U6.15
  Bottom Layer w0.305: v1(54.74,81.28) v1(49.4,81.28)
COM6: length 62.5
  Top Layer w0.305: v1(84.96,85.98) 84.96,84.71 84.33,84.07 51.18,84.07 50.42,83.31 U6.14
  Bottom Layer w0.305: SEG2.8 88.9,87.53 88.9,86.23 88.64,85.98 v1(84.96,85.98)
COM7: length 58.8
  Top Layer w0.305: 51.69,62.64 51.69,83.01 51.99,83.31 85.22,83.31 86.11,84.2 86.11,87.46 SEG2.9
COM8: length 50.5
  Top Layer w0.305: SEG2.12 78.53,87.5 53.21,87.5 53.09,87.38 v1(52.96,87.38) ; v1(52.96,82.3) U6.12
  Bottom Layer w0.305: v1(52.96,87.38) v1(52.96,82.3)
DC_IN: length 219.8
  Top Layer w0.381: 93.47,38.48 93.47,36.58 93.34,36.45 91.31,36.45 91.19,36.58 91.19,49.64 ; 92.18,56.14 90.04,56.14 ; 92.18,56.14 91.53,56.79 U3.13 ; 92.18,56.14 92.26,56.05 92.26,50.71 91.19,49.64 ; 91.19,49.64 U3.24
  Top Layer w0.914: 93.47,38.48 93.47,40.64 93.73,40.89 102.62,40.89 102.87,40.64 102.87,35.18 103.25,34.8 114.05,34.8 115.06,33.78 115.06,14.86 114.68,14.48 109.6,14.48 108.33,13.21 108.33,1.93 107.42,1.02 65.15,1.02 ; 22.1,19.81 31.62,19.81 32,19.43 32,12.83 32.26,12.57 43.31,12.57 43.94,11.94 43.94,1.78 44.7,1.02 65.15,1.02 ; 22.1,19.81 22.73,20.45 C2.2 ; 22.1,19.81 15.05,19.81 14.35,19.11 14.35,15.69 14.16,15.5 ; CN3.8 65.66,3.16 65.66,1.52 65.15,1.02
DIN_1: length 36.5
  Top Layer w0.457: R31.2 U7.4 58.42,11.56 58.12,11.86 58.12,24.18 56.51,25.78 53.85,25.78 53.21,26.42 53.21,34.16 53.53,34.48 U10.22
DIN_2: length 24
  Top Layer w0.457: U10.23 57.72,25.58 58.83,24.48 58.83,16.36 59.44,15.75 65.53,15.75 R34.2
DIN_3: length 19.1
  Top Layer w0.457: U10.24 58.52,25.79 59.54,24.77 59.54,20.35 59.82,20.07 U9.4 R37.2
DIN_4: length 13.5
  Top Layer w0.457: R38.2 U11.4 61.35,24.38 59.32,26.41 U10.25
DIN_COM: length 27.9
  Top Layer w0.457: 57.4,18.41 57.02,18.03 55.4,18.03 U9.2 ; 57.4,18.41 57.4,13.97 ; 57.4,18.41 57.4,22.22 57.25,22.38 U11.2 ; 57.4,13.97 57.4,9.78 ; 57.4,13.97 57.31,13.88 U8.2 ; 57.4,9.78 58.15,9.04 CN3.5 ; 57.4,9.78 57.28,9.65 55.47,9.65 U7.2
INFRA: length 50.9
  Top Layer w0.381: v1(37.97,16.38) 43.31,16.38 43.94,17.02 43.94,35.43 44.59,36.08 U10.20 ; R40.2 v1(37.97,10.41)
  Top Layer w0.61: R40.2 37.97,4.44 U13.1
  Bottom Layer w0.381: v1(37.97,16.38) v1(37.97,10.41)
LE_COM: length 53.2
  Top Layer w0.305: 55.88,63.12 56.77,63.12 ; 55.88,63.12 55.5,62.74 55.5,61.09 55.12,60.71 42.29,60.71 41.66,60.07 v1(41.66,51.05) ; 55.88,63.12 55.8,63.12 54.79,64.13 54.35,64.13 54.23,64.01 U6.11 ; U10.10 58.52,46.38 57.91,46.99 v1(41.66,46.99)
  Bottom Layer w0.305: v1(41.66,46.99) v1(41.66,51.05)
LE_SEG: length 51.2
  Top Layer w0.305: C20.2 88.52,66.42 88.52,64.01 88.34,63.83 74.88,63.83 74.72,63.67 U5.11 74.68,62.47 74.68,61.09 74.42,60.83 v1(61.72,60.83) ; v1(59.18,46.86) 59.32,46.72 U10.9
  Bottom Layer w0.305: v1(61.72,60.83) 61.72,52.45 61.47,52.2 59.31,52.2 59.18,52.07 v1(59.18,46.86)
M1_IN1: length 11.7
  Top Layer w0.305: R8.2 85.52,44.58 84.84,44.58 84.58,44.83 84.58,48.77 84.96,49.15 85.72,49.15 88.16,51.59 U3.21
M1_IN2: length 5.7
  Top Layer w0.305: U3.22 88.66,50.94 R9.2
M1_PWM: length 12
  Top Layer w0.305: R6.2 86.61,41.4 86.88,41.67 86.88,48.37 88.8,50.29 U3.23
M2_IN1: length 4.5
  Top Layer w0.305: U3.17 85.66,54.19 R10.2
M2_IN2: length 6
  Top Layer w0.305: U3.16 87.15,54.84 85.6,56.39 85.6,57.35
M2_PWM: length 8.7
  Top Layer w0.305: R12.2 86.23,60.45 86.61,60.07 86.61,56.39 87.51,55.49 U3.15
P00: length 50.6
  Top Layer w0.305: v1(44.07,54.74) 44.07,53.18 ; v1(59.69,54.74) 59.74,54.69 64.26,54.69 64.52,54.44 64.52,53.1 64.56,53.06 64.56,47.71 v1(64.64,47.62) ; U10.40 72.17,39.28 72.9,40 v1(72.9,47.62)
  Bottom Layer w0.305: v1(72.9,47.62) v1(64.64,47.62) ; v1(44.07,54.74) v1(59.69,54.74)
P01: length 48.8
  Top Layer w0.305: v1(65.91,48.39) 65.91,52.97 65.79,53.1 65.79,55.25 65.53,55.5 v1(58.42,55.5) ; v1(72.14,48.39) 72.14,40.39 71.83,40.08 U10.41 ; v1(45.34,55.5) U6.3
  Bottom Layer w0.305: v1(45.34,55.5) v1(58.42,55.5) ; v1(72.14,48.39) v1(65.91,48.39)
P02: length 46.9
  Top Layer w0.305: U10.42 71.11,40.88 71.37,41.15 v1(71.37,49.4) ; v1(57.15,56.26) 66.75,56.26 67.06,55.96 67.06,53.1 67.1,53.06 67.1,49.48 v1(67.18,49.4) ; v1(46.61,56.39) U6.4
  Bottom Layer w0.305: v1(57.15,56.26) 46.74,56.26 v1(46.61,56.39) ; v1(71.37,49.4) v1(67.18,49.4)
P03: length 44.5
  Top Layer w0.305: v1(56.39,57.02) 67.69,57.02 68.33,56.39 68.33,53.1 68.37,53.06 68.33,53.01 v1(68.33,50.42) ; U10.43 70.13,41.68 70.49,42.04 v1(70.49,50.42) ; v1(47.75,57.02) 47.75,53.31 U6.5
  Bottom Layer w0.305: v1(70.49,50.42) v1(68.33,50.42) ; v1(47.75,57.02) v1(56.39,57.02)
P04: length 42.1
  Top Layer w0.305: v1(55.63,57.78) 69.09,57.78 69.64,57.23 69.64,42.84 69.28,42.48 U10.44 ; v1(49.15,57.78) U6.6
  Bottom Layer w0.305: v1(49.15,57.78) v1(55.63,57.78)
P05: length 49.5
  Top Layer w0.305: v1(50.29,58.55) 50.29,53.31 U6.7 ; U10.1 65.72,45.07 65.86,45.21 v1(67.44,45.21) ; v1(54.61,58.55) 70.49,58.55 70.91,58.12 70.91,53.06 70.88,53.02 70.88,51.14 73.79,48.23 v1(73.79,45.08)
  Bottom Layer w0.305: v1(54.61,58.55) v1(50.29,58.55) ; v1(73.79,45.08) 67.56,45.08 v1(67.44,45.21)
P06: length 51.7
  Top Layer w0.305: U10.2 64.92,45.31 65.58,45.97 v1(67.94,45.97) ; v1(51.69,59.31) 51.69,53.18 ; v1(54.1,59.31) 71.5,59.31 72.14,58.67 72.14,53.1 72.26,52.97 72.26,50.55 74.55,48.26 v1(74.55,45.85)
  Bottom Layer w0.305: v1(51.69,59.31) v1(54.1,59.31) ; v1(67.94,45.97) 68.07,45.85 v1(74.55,45.85)
P07: length 55.3
  Top Layer w0.305: U10.3 64.12,46.22 64.64,46.74 v1(68.58,46.74) ; v1(75.69,46.61) 75.69,48.51 73.53,50.67 73.53,52.97 73.41,53.1 73.41,59.77 73.1,60.07 53.26,60.07 52.96,59.77 U6.9
  Bottom Layer w0.305: v1(68.58,46.74) 68.71,46.61 v1(75.69,46.61)
P40: length 62.4
  Top Layer w0.305: v1(59.31,7.11) 70.61,7.11 70.99,6.73 70.99,3.3 71.5,2.79 H2.1 ; v1(50.29,34.04) 50.29,26.67 51.18,25.78 51.18,7.62 51.69,7.11 v1(57.02,7.11) ; v1(50.29,38.35) 50.42,38.48 U10.17
  Bottom Layer w0.305: v1(57.02,7.11) v1(59.31,7.11) ; v1(50.29,38.35) v1(50.29,34.04)
P41: length 39.7
  Top Layer w0.305: U10.26 60.12,26.62 60.58,26.16 72.39,26.16 72.87,25.68 72.87,5.56 H2.2
P42: length 43.5
  Top Layer w0.305: H2.3 74.17,2.79 73.91,3.05 73.91,6.22 73.43,6.71 73.43,26.26 72.97,26.72 61.04,26.72 60.92,26.83 U10.27
P43: length 39.8
  Top Layer w0.305: H2.4 75.18,5.74 73.99,6.94 73.99,26.85 73.56,27.28 62,27.28 61.72,27.56 U10.28
P44: length 42.9
  Top Layer w0.305: H2.5 76.45,4.06 76.45,6.35 74.55,8.25 74.55,27.31 74.02,27.84 62.71,27.84 62.52,28.03 U10.29
P45: length 41.2
  Top Layer w0.305: v1(75.18,37.72) 67.46,37.72 U10.38 ; v1(75.31,26.8) 75.31,8.28 77.47,6.12 77.47,5.59 H2.6
  Bottom Layer w0.305: v1(75.18,37.72) 75.31,37.59 v1(75.31,26.8)
P46: length 46.5
  Top Layer w0.305: v1(76.07,27.56) 76.07,8.89 78.99,5.97 78.99,3.3 79.5,2.79 H2.7 ; v1(76.07,38.48) U10.39
  Bottom Layer w0.305: v1(76.07,38.48) v1(76.07,27.56)
P47: length 51.8
  Top Layer w0.305: U10.6 61.72,38.48 68.2,32 v1(76.96,32) ; v1(76.96,27.81) 76.96,8.79 79.76,6 79.76,5.54 79.96,5.33 H2.8
  Bottom Layer w0.305: v1(76.96,32) v1(76.96,27.81)
RX: length 25.2
  Top Layer w0.254: R5.1 40.91,42.67 42.16,43.93 45.99,43.93 46.61,43.31 46.61,38.35 47.88,37.08 54.75,37.08 54.94,36.88 U10.19
SCL: length 42.7
  Top Layer w0.457: U10.30 63.32,29.26 63.7,28.88 79.45,28.88 80.01,28.32 80.01,25.78 80.77,25.02 R32.1 85.34,25.02 85.98,25.65 U4.6 89.03,25.65 89.41,26.03 89.41,32.64 88.77,33.27 U12.6
SDA: length 36.5
  Top Layer w0.457: 85.34,27.43 85.34,34.29 85.6,34.54 U12.5 ; 85.34,27.43 81.23,27.43 80.77,27.89 80.77,29.34 80.52,29.59 64.26,29.59 64.12,29.73 U10.31 ; 85.34,27.43 85.85,26.92 U4.5
SEG_A: length 74.7
  Top Layer w0.305: R13.2 v1(57.48,80.26) ; SEG1.11 30.19,89.25 30.35,89.41 38.74,89.41 39.12,89.03 39.12,86.23 39.5,85.85 v1(57.47,85.85) 80.9,85.85 81.28,86.23 81.28,87.53 SEG2.11
  Bottom Layer w0.305: v1(57.48,80.26) 57.48,85.85
SEG_B: length 74.8
  Top Layer w0.305: SEG2.7 91.44,87.71 91.44,88.65 90.81,89.28 v1(61.34,89.28) 40.53,89.28 40.35,89.11 SEG1.7 ; R14.2 v1(61.33,80.26)
  Bottom Layer w0.305: v1(61.33,80.26) 61.33,89.41
SEG_C: length 65.4
  Top Layer w0.305: v1(86.36,75.95) v1(75.44,75.95) ; R15.2 65.02,75.95
  Bottom Layer w0.305: SEG1.4 35.27,75.51 35.7,75.95 v1(64.99,75.95) v1(75.44,75.95) ; SEG2.4 86.27,75.86 v1(86.36,75.95)
SEG_D: length 69.7
  Top Layer w0.305: v1(69.09,77.47) 69.09,68.77 R16.2 ; v1(80.9,77.47) v1(77.47,77.47)
  Bottom Layer w0.305: v1(77.47,77.47) v1(69.09,77.47) 30.75,77.47 30.19,76.91 SEG1.2 ; v1(80.9,77.47) 80.9,72.67 SEG2.2
SEG_DP: length 63.4
  Top Layer w0.305: v1(76.45,76.71) v1(83.57,76.71) ; R20.2 84.67,71.44 SEG2.3
  Bottom Layer w0.305: SEG1.3 32.73,76.16 33.27,76.71 v1(76.45,76.71) ; SEG2.3 83.57,72.54 v1(83.57,76.71)
SEG_E: length 72
  Top Layer w0.305: R17.2 v1(72.75,78.23)
  Bottom Layer w0.305: SEG2.1 78.61,72.42 78.61,77.98 78.36,78.23 v1(72.75,78.23) ; v1(72.75,78.23) 72.73,78.23 ; v1(72.75,78.23) 27.95,78.23 27.65,77.93 SEG1.1
SEG_F: length 74.6
  Top Layer w0.305: SEG1.10 32.73,85.89 33.53,85.09 v1(73.66,85.09) 83.19,85.09 83.69,85.6 83.69,87.58 SEG2.10 ; R18.2 76.72,73.14 76.33,73.53 73.79,73.53 73.53,73.79 v1(73.53,80.01)
  Bottom Layer w0.305: v1(73.66,85.09) 73.53,84.96 v1(73.53,80.01)
SEG_G: length 68
  Top Layer w0.305: SEG2.5 88.77,72.34 88.77,71.25 88.52,70.99 v1(85.47,70.99) ; v1(74.29,75.18) v1(88.77,75.18) ; v1(83.06,70.99) 80.82,70.99 80.7,70.87 R19.2
  Bottom Layer w0.305: v1(88.77,75.18) 88.77,72.42 SEG2.5 ; v1(74.29,75.18) 38.23,75.18 37.81,74.77 SEG1.5 ; v1(83.06,70.99) v1(85.47,70.99)
STBY: length 44.1
  Top Layer w0.305: v1(62.48,40.13) 63.37,40.13 67.06,43.81 v1(68.33,43.81) ; v1(77.6,52.83) 77.47,52.7 77.47,44.58 76.71,43.81 v1(74.42,43.81) ; v1(80.65,52.83) 80.7,52.89 U3.19 ; U10.15 v1(60.45,40.08)
  Bottom Layer w0.305: v1(77.6,52.83) v1(80.65,52.83) ; v1(68.33,43.81) v1(74.42,43.81) ; v1(62.48,40.13) 62.43,40.08 v1(60.45,40.08)
SW1: length 10.2
  Top Layer w0.457: CN3.1 48.15,5.35 48.26,5.46 49.28,5.46 49.4,5.59 49.4,11.43 49.53,11.56 R30.1
SW2: length 16.3
  Top Layer w0.457: v1(48.39,7.11) 48.39,15.49 48.77,15.88 R35.1
  Bottom Layer w0.457: v1(48.39,7.11) 50.29,7.11 50.65,6.76 CN3.2
SW3: length 25.4
  Top Layer w0.457: R36.1 47.62,20.07 47.24,19.69 v1(47.24,7.87)
  Bottom Layer w0.457: CN3.3 53.15,7.64 52.83,7.95 47.32,7.95 v1(47.24,7.87)
SW4: length 34.4
  Top Layer w0.457: R39.1 46.35,24.38 46.23,24.26 v1(46.23,8.64)
  Bottom Layer w0.457: CN3.4 55.65,8.31 55.25,8.71 46.3,8.71 v1(46.23,8.64)
TX: length 25.2
  Top Layer w0.254: R7.1 40.91,45.59 42.16,44.34 46.16,44.34 47.02,43.48 47.02,38.52 48.05,37.48 54.75,37.48 54.94,37.68 U10.18
USB_D+: length 16.1
  Top Layer w0.254: U2.5 25.21,46.6 18.02,46.6 17.76,46.85 17.76,49.1 17.5,49.36 14.39,49.36 14.02,48.99 14.02,47.88 USB1.3
USB_D-: length 16.1
  Top Layer w0.254: USB1.2 14.43,47.88 14.43,48.82 14.56,48.95 17.34,48.95 17.36,48.93 17.36,46.14 18.12,45.38 25.16,45.38 U2.6
USER_KEY: length 46.8
  Top Layer w0.381: v1(34.04,15.37) 44.07,15.37 44.7,16 44.7,34.92 45.09,35.31 56,35.31 U10.21 ; R41.1 v1(30.23,15.37)
  Bottom Layer w0.381: v1(30.23,15.37) v1(34.04,15.37)
$1N163: length 8.6
  Top Layer w0.457: 5.72,17.27 5.84,17.15 12.45,17.15 12.89,16.7 12.89,15.5
$1N174: length 17.1
  Top Layer w0.457: v1(9.02,15.37) 9.02,14.22 8.25,13.46 R4.2 ; C6.2 17.65,13.46 17.27,13.84 v1(17.27,15.37)
  Bottom Layer w0.457: v1(9.02,15.37) v1(17.27,15.37)
$1N175: length 8.1
  Top Layer w0.457: 15.43,15.5 15.43,17.34 15.62,17.53 19.43,17.53 19.69,17.27 C6.1
$1N178: length 8.7
  Top Layer w0.457: C4.2 C5.2 14.99,6.35 12.89,8.44 12.89,9.96
$1N183: length 3.3
  Top Layer w0.457: C4.1 R3.1
$1N190: length 5.8
  Top Layer w0.457: U1.8 15.43,8.7 15.62,8.51 19.56,8.51 19.81,8.76
$1N257: length 22.4
  Top Layer w0.254: U2.3 27.94,49.1 28.19,48.84 28.19,40.77 28.47,40.49 32.55,40.49 33.17,41.11 33.17,43.52 33.69,44.04 35.09,44.04 35.18,43.95 R5.2
$1N264: length 22.4
  Top Layer w0.254: R7.2 35.18,45.3 35.09,45.21 34.29,45.21 32.77,43.69 32.77,41.28 32.39,40.89 29.21,40.89 28.7,41.4 28.7,50.04 28.37,50.37 U2.2
$1N474: length 6.9
  Top Layer w0.254: U4.2 98.68,24.38 X2.1
$1N475: length 6.8
  Top Layer w0.254: X2.2 98.93,23.11 U4.1
$1N559: length 7.9
  Top Layer w0.914: USB1.1 15.24,41.66 16,40.89 19.69,40.89 F1.1
$1N587: length 4.6
  Top Layer w0.457: LED4.1 R24.1
$1N603: length 21.6
  Top Layer w0.305: U3.1 97.14,49.66 96.01,49.66 95.88,49.78 95.88,50.17 96.01,50.29 U3.2 109.83,50.29 M1.1
$1N604: length 22.7
  Top Layer w0.305: M1.2 107.35,52.89 U3.6 95.94,52.89 95.88,52.83 95.88,52.35 95.99,52.24 97.16,52.24
$1N614: length 42.1
  Top Layer w0.305: M2.2 114.07,46.61 115.9,46.61 116.21,46.91 116.21,61.16 115.9,61.47 111.89,61.47 103.96,53.54 U3.7 97.16,53.54 96.02,53.54 95.88,53.67 95.88,54.1 95.97,54.19 U3.8
$1N615: length 49.4
  Top Layer w0.305: M2.1 114.07,41.53 116.46,41.53 117.6,42.67 117.6,61.72 117.09,62.23 109.47,62.23 103.38,56.13 97.16,56.13 ; 97.16,56.13 96.01,56.13 95.88,56.26 95.88,56.64 96.03,56.79 U3.12 ; 97.16,56.13 U3.11
$1N755: length 31.5
  Top Layer w0.457: R6.1 83.44,41.28 82.17,41.28 81.79,40.89 81.79,30.76 81.33,30.3 65.2,30.3 64.92,30.58 U10.32
$1N767: length 32.3
  Top Layer w0.457: R8.1 83.51,44.45 81.53,44.45 81.03,43.94 81.03,31.47 80.57,31.01 66.01,31.01 65.72,31.31 U10.33
$1N779: length 29
  Top Layer w0.305: U10.34 79.82,34.48 80.39,35.05 80.39,47.5 80.77,47.88 R9.1
$1N791: length 34.7
  Top Layer w0.305: U10.35 79.35,35.28 79.76,35.69 79.76,53.97 80.01,54.23 83.54,54.23 R10.1
$1N803: length 36.6
  Top Layer w0.305: 83.57,57.35 79.83,57.35 79.12,56.64 79.12,36.7 78.5,36.08 U10.36
$1N815: length 39.1
  Top Layer w0.305: U10.37 77.65,36.88 78.36,37.59 78.36,60.07 78.74,60.45 R12.1
$1N1018: length 10.4
  Top Layer w0.305: U5.19 64.56,64.72 64.26,65.02 58.37,65.02 57.48,65.91 R13.1
$1N1030: length 7.7
  Top Layer w0.305: U5.18 65.79,62.56 65.79,64.64 64.85,65.58 61.79,65.58 61.33,66.04 R14.1
$1N1042: length 5
  Top Layer w0.305: U5.17 67.1,64.24 64.8,66.55
$1N1054: length 4.2
  Top Layer w0.305: 68.77,66.55 68.37,66.15 U5.16
$1N1066: length 6.5
  Top Layer w0.305: R17.1 70.74,66.55 69.6,65.41 69.6,62.56 U5.15
$1N1078: length 9.3
  Top Layer w0.305: R18.1 76.71,66.54 76.71,65.89 76.4,65.58 71.55,65.58 70.91,64.94 U5.14
$1N1090: length 12.2
  Top Layer w0.305: R19.1 80.77,66.47 80.77,65.33 80.47,65.02 72.64,65.02 72.18,64.56 U5.13
$1N1102: length 14.9
  Top Layer w0.305: R20.1 84.58,66.46 84.58,64.77 84.2,64.39 73.66,64.39 73.45,64.18 U5.12
$1N1137: length 33.2
  Top Layer w0.381: 21.55,65.91 R21.1 21.55,67.27 21.59,67.31 20.7,68.2 7.11,68.2 6.73,67.82 6.73,66.17 6.42,65.85 CN1.2
  Top Layer w0.457: R23.2 5.29,75.06 3.34,75.06 3.09,74.8 3.09,66.04 3.27,65.85 4.19,65.85
$1N1138: length 58.9
  Top Layer w0.381: U10.5 62.52,48.86 62.23,49.15 39.9,49.15 31.39,57.66 21.99,57.66 21.61,58.04 21.61,59.37 19.96,59.37 19.71,59.63 19.71,63.69 20.09,64.07 21.61,64.07
$1N1139: length 28.6
  Top Layer w0.381: CN1.1 4.93,68.83 24.77,68.83 25.78,67.82 R22.1
  Top Layer w0.457: 4.19,68.35 4.19,71.88 4.57,72.26 5.21,72.26 R25.2
$1N1140: length 55.5
  Top Layer w0.381: 25.68,64.07 24.16,64.07 23.78,63.69 23.78,59.63 24.03,59.37 25.68,59.37 25.68,58.78 26.16,58.29 31.88,58.29 40.39,49.78 62.99,49.78 63.32,49.45 U10.4
$1N1172: length 36.5
  Top Layer w0.381: CN1.3 6.58,63.35 7.37,64.14 7.37,67.05 7.88,67.56 16.38,67.56 17.27,66.67 ; 17.27,66.67 17.27,65.91 ; 17.27,66.67 17.27,66.93
  Top Layer w0.457: R28.2 5.29,77.85 2.76,77.85 2.38,77.47 2.38,63.81 2.83,63.35 4.19,63.35
$1N1173: length 61.6
  Top Layer w0.381: U10.7 60.96,44.22 60.96,48.26 60.71,48.51 39.62,48.51 31.11,57.02 17.91,57.02 17.01,57.92 17.01,59.37 ; 17.34,64.07 15.81,64.07 15.43,63.69 15.43,59.63 15.68,59.37 17.01,59.37 ; 17.01,59.37 17.34,59.37
$1N1183: length 39.3
  Top Layer w0.381: 13.21,66.29 13.21,66.04 13.08,65.91 12.7,66.29 8.89,66.29 8.25,65.66 8.25,61.34 7.77,60.85 CN1.4
  Top Layer w0.457: 4.19,60.85 2.12,60.85 1.66,61.31 1.66,80.06 2.12,80.52 R29.2
$1N1184: length 65.1
  Top Layer w0.381: R27.2 11.56,64.01 11.18,63.63 11.18,59.56 11.43,59.31 C24.1 13.08,56.64 13.46,56.26 30.73,56.26 39.12,47.88 59.94,47.88 60.12,47.7 U10.8
$1N1282: length 3.2
  Top Layer w0.457: R30.2 U7.1
$1N1335: length 3.3
  Top Layer w0.457: U8.1 55.25,15.75 52.32,15.75 R35.2
$1N1380: length 3.2
  Top Layer w0.457: U9.1 R36.2
$1N1445: length 3.2
  Top Layer w0.457: U11.1 R39.2

## Copper pours and planes (outline as drawn; the poured copper is in the pictures)
+3V3 on Top Layer: 10.16,35.31 24.64,35.31 24.64,30.99 10.16,30.99
+3V3 on Top Layer: 34.29,33.11 41.91,33.11 41.91,22.86 34.29,22.86
+3V3 on Top Layer: 67.03,25.27 68.58,25.27 68.58,9.78 67.03,9.78
+3V3 on Top Layer: 65.02,23.37 67.31,23.37 67.31,21.21 65.02,21.21
+3V3 on Top Layer: 6.35,82.04 8.64,82.04 8.64,71.37 6.35,71.37
+3V3 on Bottom Layer: 40.26,30.61 67.31,30.61 67.31,21.21 40.26,21.21
+3V3 on Bottom Layer: 23.04,27.18 39.75,27.18 39.75,10.79 23.04,10.79
GND on Top Layer: -26.03,104.01 136.27,104.01 136.27,-13.72 -26.03,-13.72
GND on Top Layer: 89.28,16.89 95.38,16.89 95.38,14.86 89.28,14.86
GND on Top Layer: 23.88,2.67 34.92,2.67 34.92,0.63 23.88,0.63
GND on Top Layer: 38.23,21.97 42.04,21.97 42.04,17.65 38.23,17.65
GND on Top Layer: 92.2,45.59 103.63,45.59 103.63,41.91 92.2,41.91
GND on Top Layer: 91.19,35.05 95.88,35.05 95.88,29.84 91.19,29.84
GND on Top Layer: 111.51,12.06 119.51,12.06 119.51,7.49 111.51,7.49
GND on Bottom Layer: -22.22,107.7 148.08,107.7 148.08,-18.67 -22.22,-18.67
DC_IN on Top Layer: 12.45,26.8 24.38,26.8 24.38,20.83 12.45,20.83
VUSB on Top Layer: 17.65,38.86 40.39,38.86 40.39,30.99 17.65,30.99
$1N152 on Top Layer: 7.49,11.05 12.45,11.05 12.45,4.7 7.49,4.7
$1N163 on Top Layer: 0.53,35.56 7.11,35.56 7.11,13.97 0.53,13.97
$1N421 on Top Layer: 85.6,23.62 88.39,23.62 88.39,4.57 85.6,4.57
$1N489 on Top Layer: 93.98,11.3 101.22,11.3 101.22,7.87 93.98,7.87
$1N1633 on Top Layer: 23.75,18.29 35.18,18.29 35.18,4.19 23.75,4.19

Small or netless copper shapes (teardrops, artwork), in the pictures only: 405 on Top Layer, 103 on Bottom Layer
